# Altium project PCB_Project1.PrjPCB
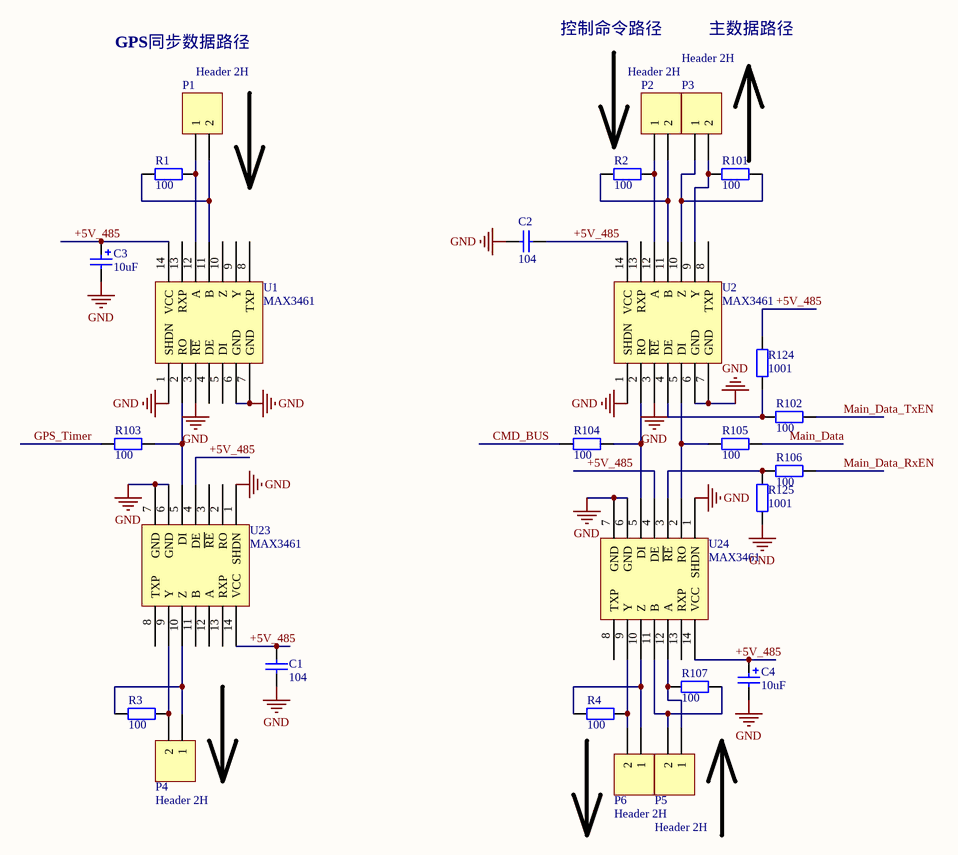
[diagram p0: 485Driver_MAX3462.SchDoc]
7 sheets, 381 parts. Net scope: global (net labels, ports and power ports of the same name join across sheets).
Board file: PCB1.PcbDoc
Sheets:
  485Driver_MAX3462.SchDoc
  CH1_CH2.SchDoc
  CH3.SchDoc
  Power.SchDoc
  EP3CE75F484.SchDoc
  STM32F103RBT6.SchDoc
  FPGA_POWER.SchDoc

## Sheet 485Driver_MAX3462.SchDoc
size A4

### Parts
C1  104  [0805C]
C2  104  [0805C]
C3  10uF  [C68uF]
C4  10uF  [C68uF]
P1  Header 2H  [HDR1X2]
P2  Header 2H  [HDR1X2]
P3  Header 2H  [HDR1X2]
P4  Header 2H  [HDR1X2]
P5  Header 2H  [HDR1X2]
P6  Header 2H  [HDR1X2]
R1  100  [0805R]
R2  100  [0805R]
R3  100  [0805R]
R4  100  [0805R]
R101  100  [0805R]
R102  100  [0603]
R103  100  [0603]
R104  100  [0603]
R105  100  [0603]
R106  100  [0603]
R107  100  [0805R]
R124  1001  [0603]
R125  1001  [0603]
U1  MAX3461  [SOP14]
U2  MAX3461  [SOP14]
U23  MAX3461  [SOP14]
U24  MAX3461  [SOP14]

### Nets
GND: C1.1 C2.1 C3.2 C4.2 R125.2 U1.1(SHDN) U1.3(~{RE}) U1.6(GND) U1.7(GND) U2.1(SHDN) U2.3(~{RE}) U2.6(GND) U2.7(GND) U23.1(SHDN) U23.6(GND) U23.7(GND) U24.1(SHDN) U24.6(GND) U24.7(GND)  [project net DGND]
+5V_485: C1.2 C2.2 C3.1 C4.1 R124.1 U1.14(VCC) U2.14(VCC) U23.4(DE) U23.14(VCC) U24.4(DE) U24.14(VCC)
CMD_BUS: R104.2
GPS_Timer: R103.2
Main_Data: R105.1
Main_Data_RxEN: R106.1
Main_Data_TxEN: R102.1
NetP1_1: P1.1 R1.1 U1.12(A)
NetP1_2: P1.2 R1.2 U1.11(B)
NetP2_1: P2.1 R2.1 U2.12(A)
NetP2_2: P2.2 R2.2 U2.11(B)
NetP3_1: P3.1 R101.1 U2.10(Z)
NetP3_2: P3.2 R101.2 U2.9(Y)
NetP4_1: P4.1 R3.2 U23.10(Z)
NetP4_2: P4.2 R3.1 U23.9(Y)
NetP5_1: P5.1 R107.2 U24.12(A)
NetP5_2: P5.2 R107.1 U24.11(B)
NetP6_1: P6.1 R4.2 U24.10(Z)
NetP6_2: P6.2 R4.1 U24.9(Y)
NetR102_2: R102.2 R124.2 U2.4(DE)
NetR103_1: R103.1 U1.2(RO) U23.5(DI)
NetR104_1: R104.1 U2.2(RO) U24.5(DI)
NetR105_2: R105.2 U2.5(DI) U24.2(RO)
NetR106_2: R106.2 R125.1 U24.3(~{RE})

Not connected (* = marked no-connect by the designer): U1 4(DE) 5(DI) 8(TXP) 9(Y) 10(Z) 13(RXP); U2 8(TXP) 13(RXP); U23 2(RO) 3(~{RE}) 8(TXP) 11(B) 12(A) 13(RXP); U24 8(TXP) 13(RXP)

### Notes on the sheet
- 控制命令路径
- 主数据路径
- GPS同步数据路径

### Library data of the parts
C1 C2 = Cap: Capacitor; Value: 100nF; Published: 8-Jun-2000; LatestRevisionDate: 17-Jul-2002; LatestRevisionNote: Re-released for DXP Platform.; PackageReference: RAD-0.3; Publisher: Altium Limited
C3 C4 = Cap Pol2: Polarized Capacitor (Axial); Value: 100pF; Published: 8-Jun-2000; LatestRevisionDate: 17-Jul-2002; LatestRevisionNote: Re-released for DXP Platform.; PackageReference: POLAR0.8; Publisher: Altium Limited
P1-P6 = Header 2H: Header, 2-Pin, Right Angle; LatestRevisionDate: 17-Jul-2002; LatestRevisionNote: Re-released for DXP Platform.; Publisher: Altium Limited
R1-R4 R101-R107 R124 R125 = Res2: Resistor; Value: 1K; Published: 8-Jun-2000; LatestRevisionDate: 17-Jul-2002; LatestRevisionNote: Re-released for DXP Platform.; PackageReference: AXIAL-0.4; Publisher: Altium Limited

## Sheet CH1_CH2.SchDoc
size A4
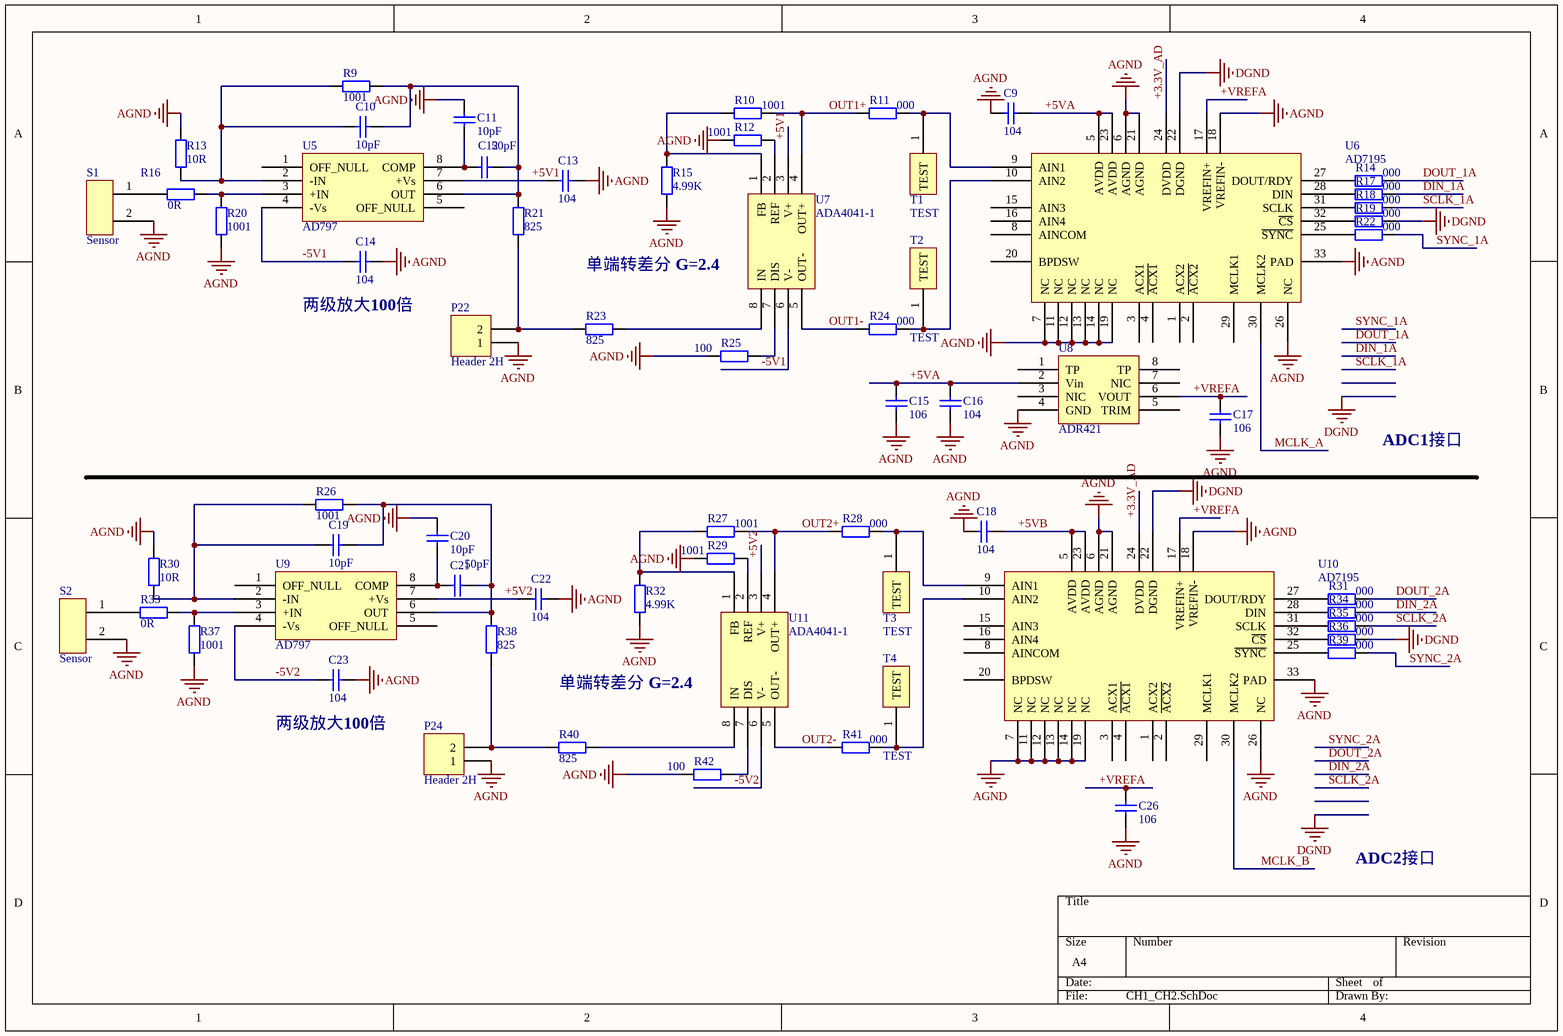
[diagram p1: CH1_CH2.SchDoc]

### Parts
C9  104  [0603]
C10  10pF  [0603]
C11  10pF  [0603]
C12  50pF  [0603]
C13  104  [0603]
C14  104  [0603]
C15  106  [0603]
C16  104  [0603]
C17  106  [0603]
C18  104  [0603]
C19  10pF  [0603]
C20  10pF  [0603]
C21  50pF  [0603]
C22  104  [0603]
C23  104  [0603]
C26  106  [0603]
P22  Header 2H  [HDR1X2]
P24  Header 2H  [HDR1X2]
R9  1001  [0603]  (net tie, no BOM)
R10  1001  [0603]  (net tie, no BOM)
R11  000  [0603]  (net tie, no BOM)
R12  1001  [0603]  (net tie, no BOM)
R13  10R  [0603]
R14  000  [0603]  (net tie, no BOM)
R15  4.99K  [0603]  (net tie, no BOM)
R16  0R  [0603]
R17  000  [0603]  (net tie, no BOM)
R18  000  [0603]  (net tie, no BOM)
R19  000  [0603]  (net tie, no BOM)
R20  1001  [0603]  (net tie, no BOM)
R21  825  [0603]  (net tie, no BOM)
R22  000  [0603]  (net tie, no BOM)
R23  825  [0603]  (net tie, no BOM)
R24  000  [0603]  (net tie, no BOM)
R25  100  [0603]  (net tie, no BOM)
R26  1001  [0603]  (net tie, no BOM)
R27  1001  [0603]  (net tie, no BOM)
R28  000  [0603]  (net tie, no BOM)
R29  1001  [0603]  (net tie, no BOM)
R30  10R  [0603]  (net tie, no BOM)
R31  000  [0603]  (net tie, no BOM)
R32  4.99K  [0603]  (net tie, no BOM)
R33  0R  [0603]  (net tie, no BOM)
R34  000  [0603]  (net tie, no BOM)
R35  000  [0603]  (net tie, no BOM)
R36  000  [0603]  (net tie, no BOM)
R37  1001  [0603]  (net tie, no BOM)
R38  825  [0603]  (net tie, no BOM)
R39  000  [0603]  (net tie, no BOM)
R40  825  [0603]  (net tie, no BOM)
R41  000  [0603]  (net tie, no BOM)
R42  100  [0603]  (net tie, no BOM)
S1  Sensor  [HDR1X2]
S2  Sensor  [HDR1X2]
T1  TEST  [TEST]
T2  TEST  [TEST]
T3  TEST  [TEST]
T4  TEST  [TEST]
U5  AD797  [SO8]
U6  AD7195  [VQFN32]
U7  ADA4041-1  [SO8]
U8  ADR421  [SO8]
U9  AD797  [SO8]
U10  AD7195  [VQFN32]
U11  ADA4041-1  [SO8]

### Nets
AGND: C9.1 C11.2 C13.1 C14.1 C15.2 C16.2 C17.2 C18.1 C20.2 C22.1 C23.1 C26.2 P22.1 P24.1 R12.1 R13.1 R15.1 R20.1 R25.1 R29.1 R30.1 R32.1 R37.1 R42.1 S1.2 S2.2 U6.6(AGND) U6.7(NC) U6.11(NC) U6.12(NC) U6.13(NC) U6.14(NC) U6.18(VREFIN-) U6.19(NC) U6.21(AGND) U6.26(NC) U6.33(PAD) U8.4(GND) U10.6(AGND) U10.7(NC) U10.11(NC) U10.12(NC) U10.13(NC) U10.14(NC) U10.18(VREFIN-) U10.19(NC) U10.21(AGND) U10.26(NC) U10.33(PAD)
DGND: R19.2 R36.2 U6.22(DGND) U10.22(DGND)
+3.3V_AD: U6.24(DVDD) U10.24(DVDD)
+5V1: C13.2 U5.7(+Vs) U7.3(V+)
+5V2: C22.2 U9.7(+Vs) U11.3(V+)
+5VA: C9.2 C15.1 C16.1 U6.5(AVDD) U6.23(AVDD) U8.2(Vin)
+5VB: C18.2 U10.5(AVDD) U10.23(AVDD)
+VREFA: C17.1 C26.1 U6.17(VREFIN+) U8.6(VOUT) U10.17(VREFIN+)
-5V1: C14.2 U5.4(-Vs) U7.6(V-)
-5V2: C23.2 U9.4(-Vs) U11.6(V-)
DIN_1A: R17.2
DIN_2A: R34.2
DOUT_1A: R14.2
DOUT_2A: R31.2
MCLK_A: U6.30(MCLK2)
MCLK_B: U10.30(MCLK2)
OUT1+: R10.2 R11.1 U7.4(OUT+)
OUT1-: R24.1 U7.5(OUT-)
OUT2+: R27.2 R28.1 U11.4(OUT+)
OUT2-: R41.1 U11.5(OUT-)
SCLK_1A: R18.2
SCLK_2A: R35.2
SYNC_1A: R22.2
SYNC_2A: R39.2
NetC10_1: C10.1 C12.1 R9.2 R21.2 U5.6(OUT)
NetC10_2: C10.2 R9.1 R13.2 U5.2(-IN)
NetC11_1: C11.1 C12.2 U5.8(COMP)
NetC19_1: C19.1 C21.1 R26.2 R38.2 U9.6(OUT)
NetC19_2: C19.2 R26.1 R30.2 U9.2(-IN)
NetC20_1: C20.1 C21.2 U9.8(COMP)
NetP22_2: P22.2 R21.1 R23.1
NetP24_2: P24.2 R38.1 R40.1
NetR10_1: R10.1 R15.2 U7.1(FB)
NetR11_2: R11.2 T1.1(TEST) U6.9(AIN1)
NetR12_2: R12.2 U7.2(REF)
NetR14_1: R14.1 U6.27(DOUT/RDY)
NetR16_1: R16.1 S1.1
NetR16_2: R16.2 R20.2 U5.3(+IN)
NetR17_1: R17.1 U6.28(DIN)
NetR18_1: R18.1 U6.31(SCLK)
NetR19_1: R19.1 U6.32(~{CS})
NetR22_1: R22.1 U6.25(~{SYNC})
NetR23_2: R23.2 U7.8(IN)
NetR24_2: R24.2 T2.1(TEST) U6.10(AIN2)
NetR25_2: R25.2 U7.7(DIS)
NetR27_1: R27.1 R32.2 U11.1(FB)
NetR28_2: R28.2 T3.1(TEST) U10.9(AIN1)
NetR29_2: R29.2 U11.2(REF)
NetR31_1: R31.1 U10.27(DOUT/RDY)
NetR33_1: R33.1 S2.1
NetR33_2: R33.2 R37.2 U9.3(+IN)
NetR34_1: R34.1 U10.28(DIN)
NetR35_1: R35.1 U10.31(SCLK)
NetR36_1: R36.1 U10.32(~{CS})
NetR39_1: R39.1 U10.25(~{SYNC})
NetR40_2: R40.2 U11.8(IN)
NetR41_2: R41.2 T4.1(TEST) U10.10(AIN2)
NetR42_2: R42.2 U11.7(DIS)

Not connected (* = marked no-connect by the designer): U5 1(OFF_NULL) 5(OFF_NULL); U6 1(ACX2) 2(~{ACX2}) 3(ACX1) 4(~{ACX1}) 8(AINCOM) 15(AIN3) 16(AIN4) 20(BPDSW) 29(MCLK1); U8 1(TP) 3(NIC) 5(TRIM) 7(NIC) 8(TP); U9 1(OFF_NULL) 5(OFF_NULL); U10 1(ACX2) 2(~{ACX2}) 3(ACX1) 4(~{ACX1}) 8(AINCOM) 15(AIN3) 16(AIN4) 20(BPDSW) 29(MCLK1)

### Notes on the sheet
- (near C14) 两级放大100倍
- 单端转差分 G=2.4
- ADC1接口
- (near C23) 两级放大100倍
- ADC2接口

### Library data of the parts
C9-C23 C26 = Cap: Capacitor; Value: 100nF; Published: 8-Jun-2000; LatestRevisionDate: 17-Jul-2002; LatestRevisionNote: Re-released for DXP Platform.; PackageReference: RAD-0.3; Publisher: Altium Limited
P22 P24 = Header 2H: Header, 2-Pin, Right Angle; LatestRevisionDate: 17-Jul-2002; LatestRevisionNote: Re-released for DXP Platform.; Publisher: Altium Limited
R9-R15 R17-R32 R34-R42 = Res2: Resistor; Value: 1K; Published: 8-Jun-2000; LatestRevisionDate: 17-Jul-2002; LatestRevisionNote: Re-released for DXP Platform.; PackageReference: AXIAL-0.4; Publisher: Altium Limited
R16 R33 = Res2: Resistor; Value: 0; Published: 8-Jun-2000; LatestRevisionDate: 17-Jul-2002; LatestRevisionNote: Re-released for DXP Platform.; PackageReference: AXIAL-0.4; Publisher: Altium Limited

## Sheet CH3.SchDoc
size A4
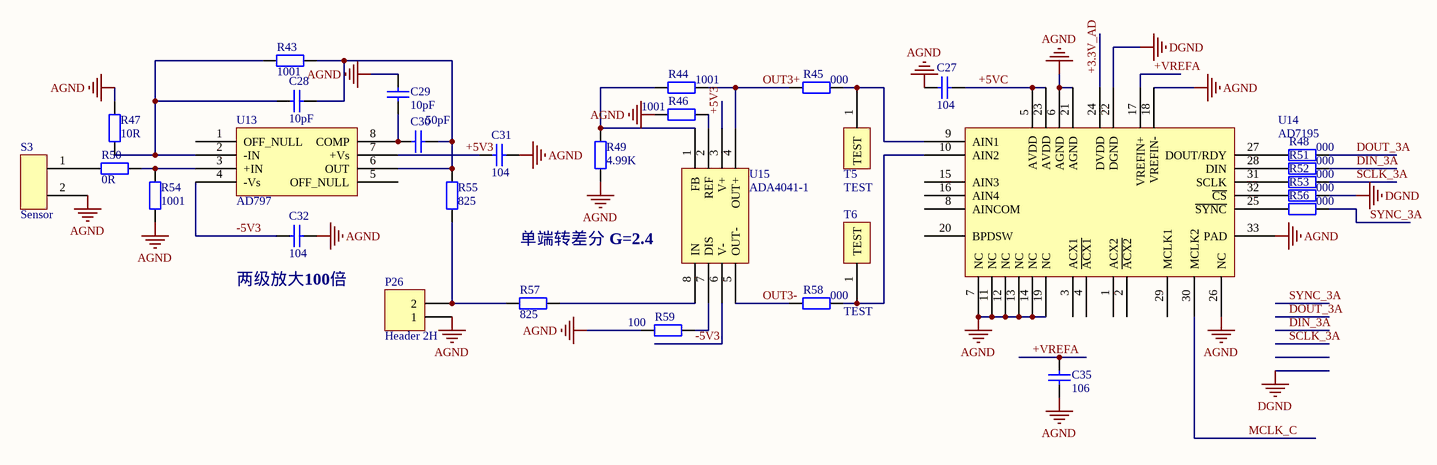
[diagram p2: CH3.SchDoc]

### Parts
C27  104  [0603]
C28  10pF  [0603]
C29  10pF  [0603]
C30  50pF  [0603]
C31  104  [0603]
C32  104  [0603]
C35  106  [0603]
P26  Header 2H  [HDR1X2]
R43  1001  [0603]  (net tie, no BOM)
R44  1001  [0603]  (net tie, no BOM)
R45  000  [0603]  (net tie, no BOM)
R46  1001  [0603]  (net tie, no BOM)
R47  10R  [0603]
R48  000  [0603]  (net tie, no BOM)
R49  4.99K  [0603]  (net tie, no BOM)
R50  0R  [0603]
R51  000  [0603]  (net tie, no BOM)
R52  000  [0603]  (net tie, no BOM)
R53  000  [0603]  (net tie, no BOM)
R54  1001  [0603]  (net tie, no BOM)
R55  825  [0603]  (net tie, no BOM)
R56  000  [0603]  (net tie, no BOM)
R57  825  [0603]  (net tie, no BOM)
R58  000  [0603]  (net tie, no BOM)
R59  100  [0603]  (net tie, no BOM)
S3  Sensor  [HDR1X2]
T5  TEST  [TEST]
T6  TEST  [TEST]
U13  AD797  [SO8]
U14  AD7195  [VQFN32]
U15  ADA4041-1  [SO8]

### Nets
AGND: C27.1 C29.2 C31.1 C32.1 C35.2 P26.1 R46.1 R47.1 R49.1 R54.1 R59.1 S3.2 U14.6(AGND) U14.7(NC) U14.11(NC) U14.12(NC) U14.13(NC) U14.14(NC) U14.18(VREFIN-) U14.19(NC) U14.21(AGND) U14.26(NC) U14.33(PAD)
DGND: R53.2 U14.22(DGND)
+3.3V_AD: U14.24(DVDD)
+5V3: C31.2 U13.7(+Vs) U15.3(V+)
+5VC: C27.2 U14.5(AVDD) U14.23(AVDD)
+VREFA: C35.1 U14.17(VREFIN+)
-5V3: C32.2 U13.4(-Vs) U15.6(V-)
DIN_3A: R51.2
DOUT_3A: R48.2
MCLK_C: U14.30(MCLK2)
OUT3+: R44.2 R45.1 U15.4(OUT+)
OUT3-: R58.1 U15.5(OUT-)
SCLK_3A: R52.2
SYNC_3A: R56.2
NetC28_1: C28.1 C30.1 R43.2 R55.2 U13.6(OUT)
NetC28_2: C28.2 R43.1 R47.2 U13.2(-IN)
NetC29_1: C29.1 C30.2 U13.8(COMP)
NetP26_2: P26.2 R55.1 R57.1
NetR44_1: R44.1 R49.2 U15.1(FB)
NetR45_2: R45.2 T5.1(TEST) U14.9(AIN1)
NetR46_2: R46.2 U15.2(REF)
NetR48_1: R48.1 U14.27(DOUT/RDY)
NetR50_1: R50.1 S3.1
NetR50_2: R50.2 R54.2 U13.3(+IN)
NetR51_1: R51.1 U14.28(DIN)
NetR52_1: R52.1 U14.31(SCLK)
NetR53_1: R53.1 U14.32(~{CS})
NetR56_1: R56.1 U14.25(~{SYNC})
NetR57_2: R57.2 U15.8(IN)
NetR58_2: R58.2 T6.1(TEST) U14.10(AIN2)
NetR59_2: R59.2 U15.7(DIS)

Not connected (* = marked no-connect by the designer): U13 1(OFF_NULL) 5(OFF_NULL); U14 1(ACX2) 2(~{ACX2}) 3(ACX1) 4(~{ACX1}) 8(AINCOM) 15(AIN3) 16(AIN4) 20(BPDSW) 29(MCLK1)

### Notes on the sheet
- 单端转差分 G=2.4
- (near C32) 两级放大100倍

### Library data of the parts
C27-C32 C35 = Cap: Capacitor; Value: 100nF; Published: 8-Jun-2000; LatestRevisionDate: 17-Jul-2002; LatestRevisionNote: Re-released for DXP Platform.; PackageReference: RAD-0.3; Publisher: Altium Limited
P26 = Header 2H: Header, 2-Pin, Right Angle; LatestRevisionDate: 17-Jul-2002; LatestRevisionNote: Re-released for DXP Platform.; Publisher: Altium Limited
R43-R49 R51-R59 = Res2: Resistor; Value: 1K; Published: 8-Jun-2000; LatestRevisionDate: 17-Jul-2002; LatestRevisionNote: Re-released for DXP Platform.; PackageReference: AXIAL-0.4; Publisher: Altium Limited
R50 = Res2: Resistor; Value: 0; Published: 8-Jun-2000; LatestRevisionDate: 17-Jul-2002; LatestRevisionNote: Re-released for DXP Platform.; PackageReference: AXIAL-0.4; Publisher: Altium Limited

## Sheet Power.SchDoc
size A4
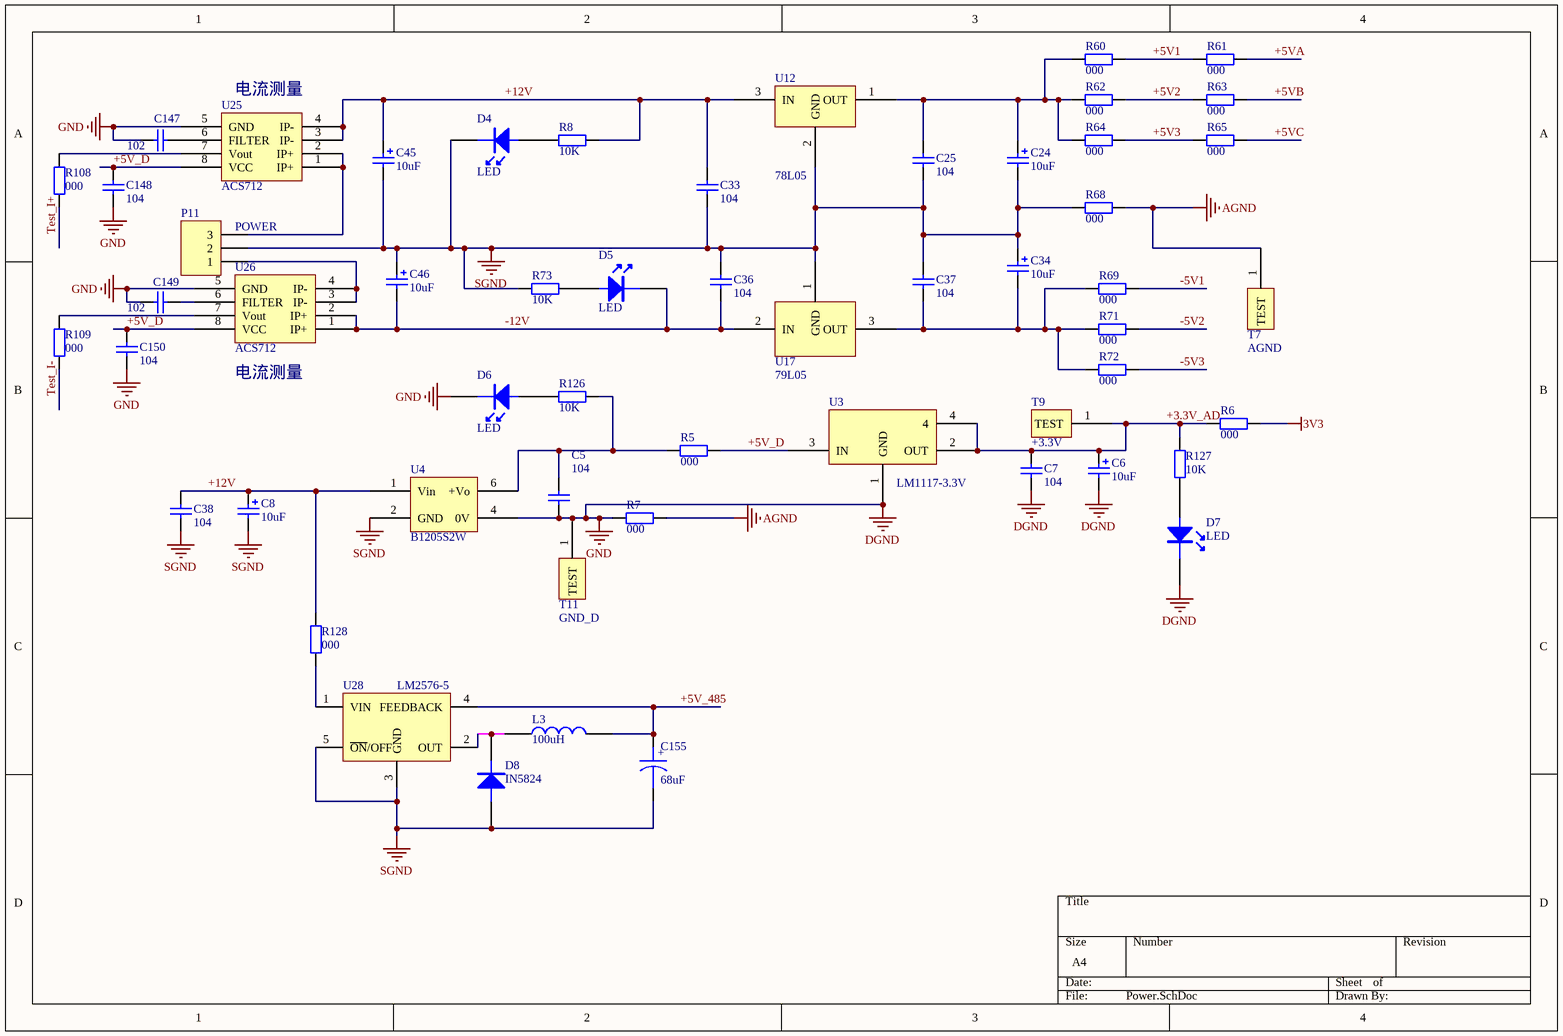
[diagram p3: Power.SchDoc]

### Parts
C5  104  [0805C]
C6  10uF  [C68uF]
C7  104  [0805C]
C8  10uF  [C68uF]
C24  10uF  [C68uF]
C25  104  [0805C]
C33  104  [0805C]
C34  10uF  [C68uF]
C36  104  [0805C]
C37  104  [0805C]
C38  104  [0805C]
C45  10uF  [C68uF]
C46  10uF  [C68uF]
C147  102  [0603]
C148  104  [0603]
C149  102  [0603]
C150  104  [0603]
C155  68uF  [C68uF]
D4  LED  [0805_LED]
D5  LED  [0805_LED]
D6  LED  [0805_LED]
D7  LED  [0805_LED]
D8  IN5824  [1N5824]
L3  100uH  [L100uH]
P11  POWER  [SIP3-5.08mm]
R5  000  [0805R]
R6  000  [0805R]
R7  000  [0805R]
R8  value 10K  [0603]  (hidden comment: Res2)
R60  000  [0805R]
R61  000  [0805R]
R62  000  [0805R]
R63  000  [0805R]
R64  000  [0805R]
R65  000  [0805R]
R68  000  [0805R]
R69  000  [0805R]
R71  000  [0805R]
R72  000  [0805R]
R73  value 10K  [0603]  (hidden comment: Res2)
R108  000  [0603]  (net tie, no BOM)
R109  000  [0603]  (net tie, no BOM)
R126  value 10K  [0603]  (hidden comment: Res2)
R127  value 10K  [0603]  (hidden comment: Res2)
R128  000  [0805R]
T7  AGND  [TEST]
T9  +3.3V  [TEST]
T11  GND_D  [TEST]
U3  LM1117-3.3V  [SOT223]
U4  B1205S2W  [B1205SW]
U12  78L05  [SOT89-M]
U17  79L05
U25  ACS712  [SO8]
U26  ACS712  [SO8]
U28  LM2576-5  [lm2596]

### Nets
3V3: R6.1
AGND: R7.1 R68.1 T7.1(TEST)
DGND: C5.2 C6.2 C7.2 C147.1 C148.2 C149.1 C150.2 D6.2(K) D7.2(K) R7.2 T11.1(TEST) U3.1(GND) U4.4(0V) U25.5(GND) U26.5(GND)  [also labelled GND]
SGND: C8.2 C24.2 C25.2 C33.2 C34.1 C36.1 C37.1 C38.2 C45.2 C46.1 C155.2 D4.2(K) D8.1(A) P11.2 R68.2 R73.2 U4.2(GND) U12.2(GND) U17.1(GND) U28.3(GND) U28.5(~{ON}/OFF)
+3.3V_AD: C6.1 C7.1 R6.2 R127.2 T9.1(TEST) U3.2(OUT) U3.4
+5V1: R60.1 R61.2
+5V2: R62.1 R63.2
+5V3: R64.1 R65.2
+5V_485: C155.1 L3.2 U28.4(FEEDBACK)
+5V_D: C148.1 C150.1 R5.1 U3.3(IN) U25.8(VCC) U26.8(VCC)
+5VA: R61.1
+5VB: R63.1
+5VC: R65.1
+12V: C8.1 C33.1 C38.1 C45.1 R8.2 R128.1 U4.1(Vin) U12.3(IN) U25.3(IP-) U25.4(IP-)
-5V1: R69.1
-5V2: R71.1
-5V3: R72.1
-12V: C36.2 C46.2 D5.2(K) U17.2(IN) U26.1(IP+) U26.2(IP+)
Test_I+: R108.1
Test_I-: R109.1
NetC5_1: C5.1 R5.2 R126.2 U4.6(+Vo)
NetC24_1: C24.1 C25.1 R60.2 R62.2 R64.2 U12.1(OUT)
NetC34_2: C34.2 C37.2 R69.2 R71.2 R72.2 U17.3(OUT)
NetC147_2: C147.2 U25.6(FILTER)
NetC149_2: C149.2 U26.6(FILTER)
NetD4_1: D4.1(A) R8.1
NetD5_1: D5.1(A) R73.1
NetD6_1: D6.1(A) R126.1
NetD7_1: D7.1(A) R127.1
NetD8_2: D8.2(K) L3.1 U28.2(OUT)
NetP11_1: P11.1 U26.3(IP-) U26.4(IP-)
NetP11_3: P11.3 U25.1(IP+) U25.2(IP+)
NetR108_2: R108.2 U25.7(Vout)
NetR109_2: R109.2 U26.7(Vout)
NetR128_2: R128.2 U28.1(VIN)

### Notes on the sheet
- (near U25) 电流测量
- (near U26) 电流测量
- (in symbol CAPACITOR POL) +

### Library data of the parts
C5 C7 C25 C33 C36-C38 C147-C150 = Cap: Capacitor; Value: 100nF; Published: 8-Jun-2000; LatestRevisionDate: 17-Jul-2002; LatestRevisionNote: Re-released for DXP Platform.; PackageReference: RAD-0.3; Publisher: Altium Limited
C6 C8 C24 C34 C45 C46 = Cap Pol2: as C3 on sheet 485Driver_MAX3462; Published: 8-Jun-2000; LatestRevisionDate: 17-Jul-2002; LatestRevisionNote: Re-released for DXP Platform.; PackageReference: POLAR0.8; Publisher: Altium Limited
C155 = CAPACITOR POL: Capacitor
D8 = DIODE
L3 = INDUCTOR
P11 = Header 3: Header, 3-Pin; LatestRevisionDate: 17-Jul-2002; LatestRevisionNote: Re-released for DXP Platform.; Publisher: Altium Limited
R5-R7 R60-R65 R68 R69 R71 R72 R108 R109 R128 = Res2: Resistor; Value: 1K; Published: 8-Jun-2000; LatestRevisionDate: 17-Jul-2002; LatestRevisionNote: Re-released for DXP Platform.; PackageReference: AXIAL-0.4; Publisher: Altium Limited
R8 R73 R126 R127 = Res2: Resistor; Published: 8-Jun-2000; LatestRevisionDate: 17-Jul-2002; LatestRevisionNote: Re-released for DXP Platform.; PackageReference: AXIAL-0.4; Publisher: Altium Limited
T7 T9 T11 = TEST
U28 = LM2596-5

## Sheet EP3CE75F484.SchDoc
size A1
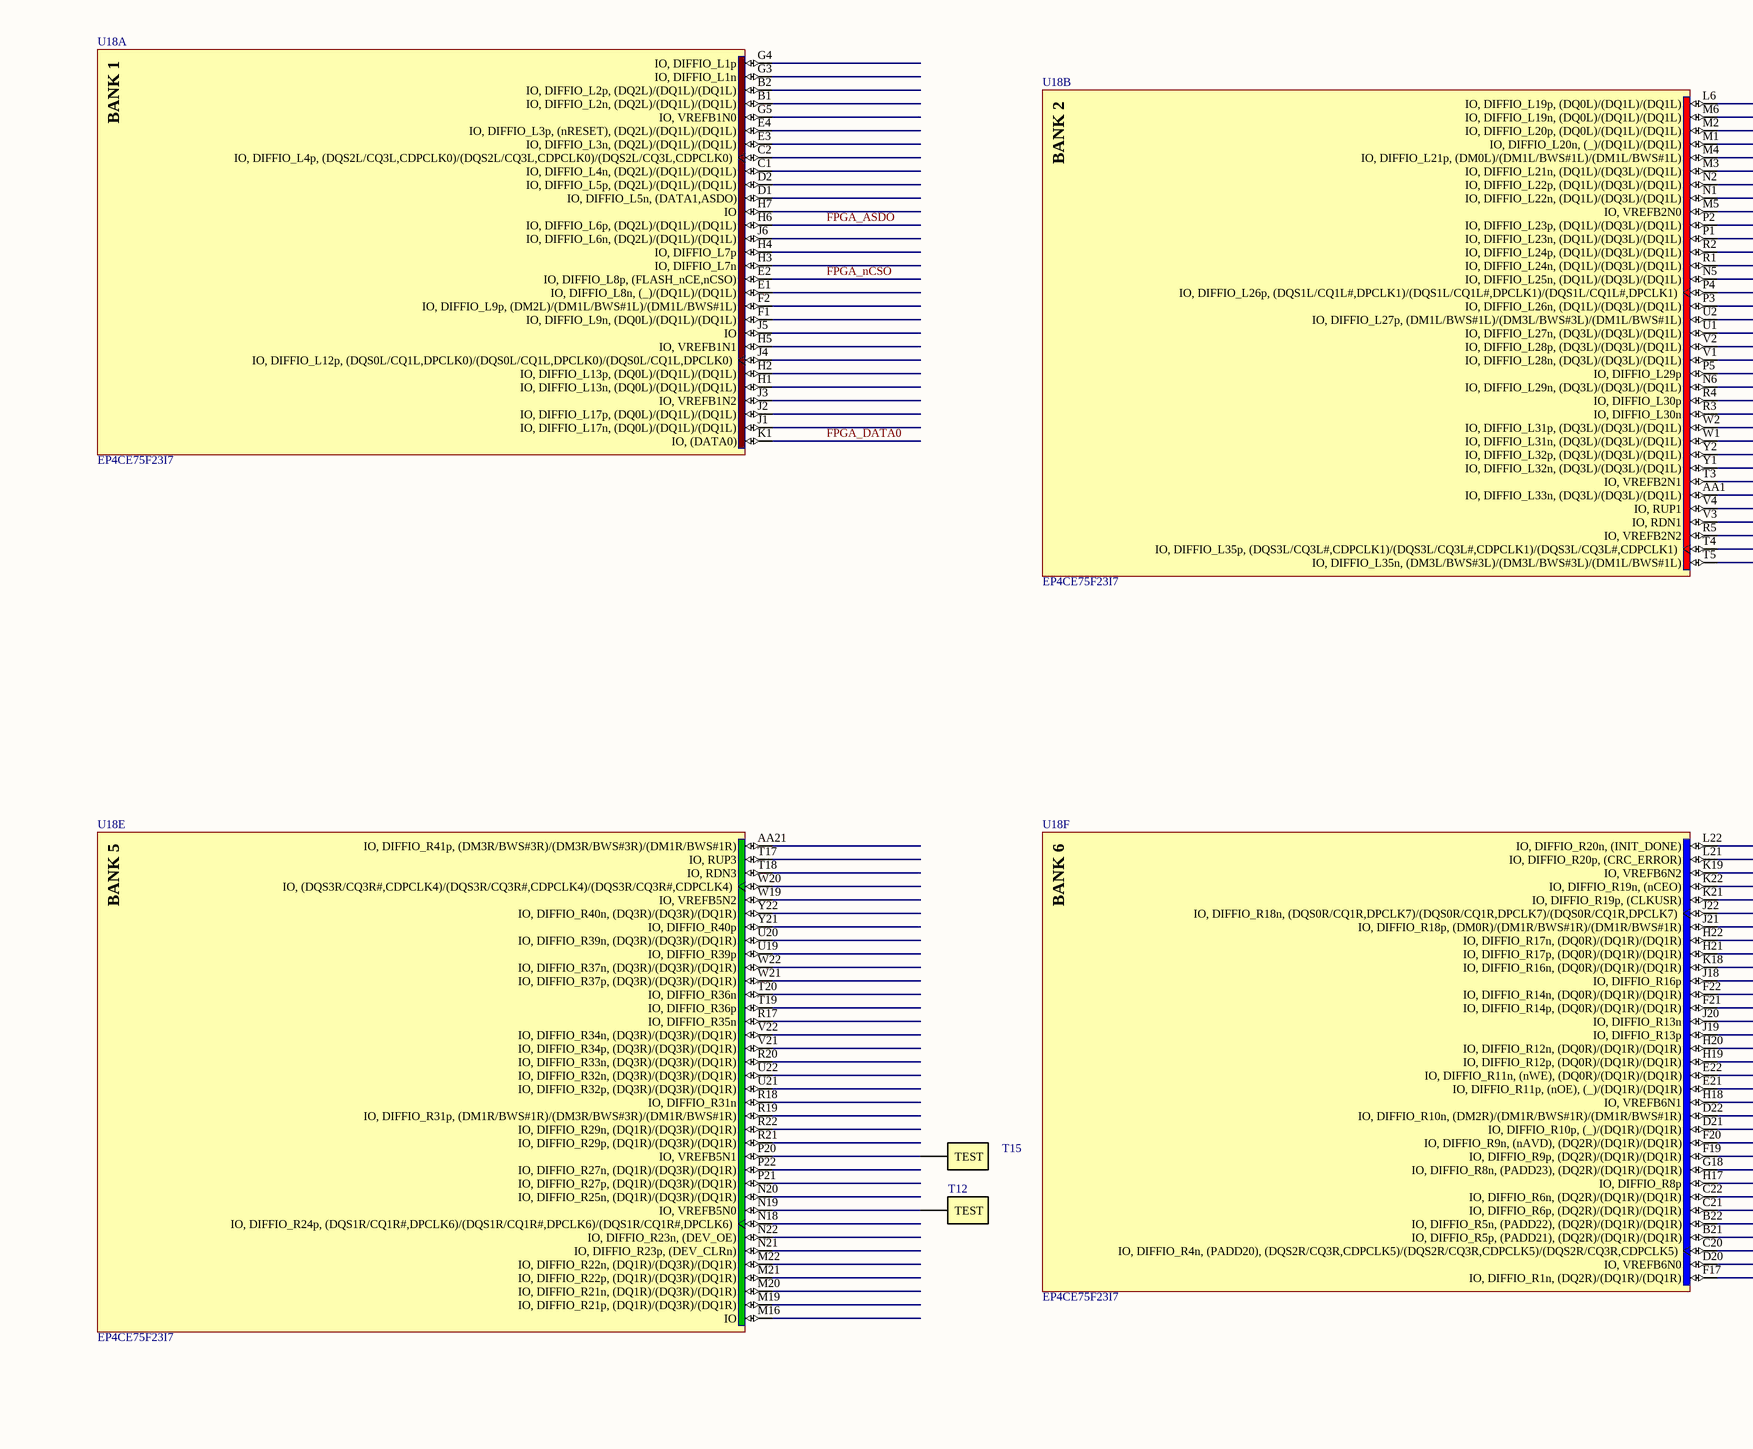
[diagram p4: EP3CE75F484.SchDoc, top left]
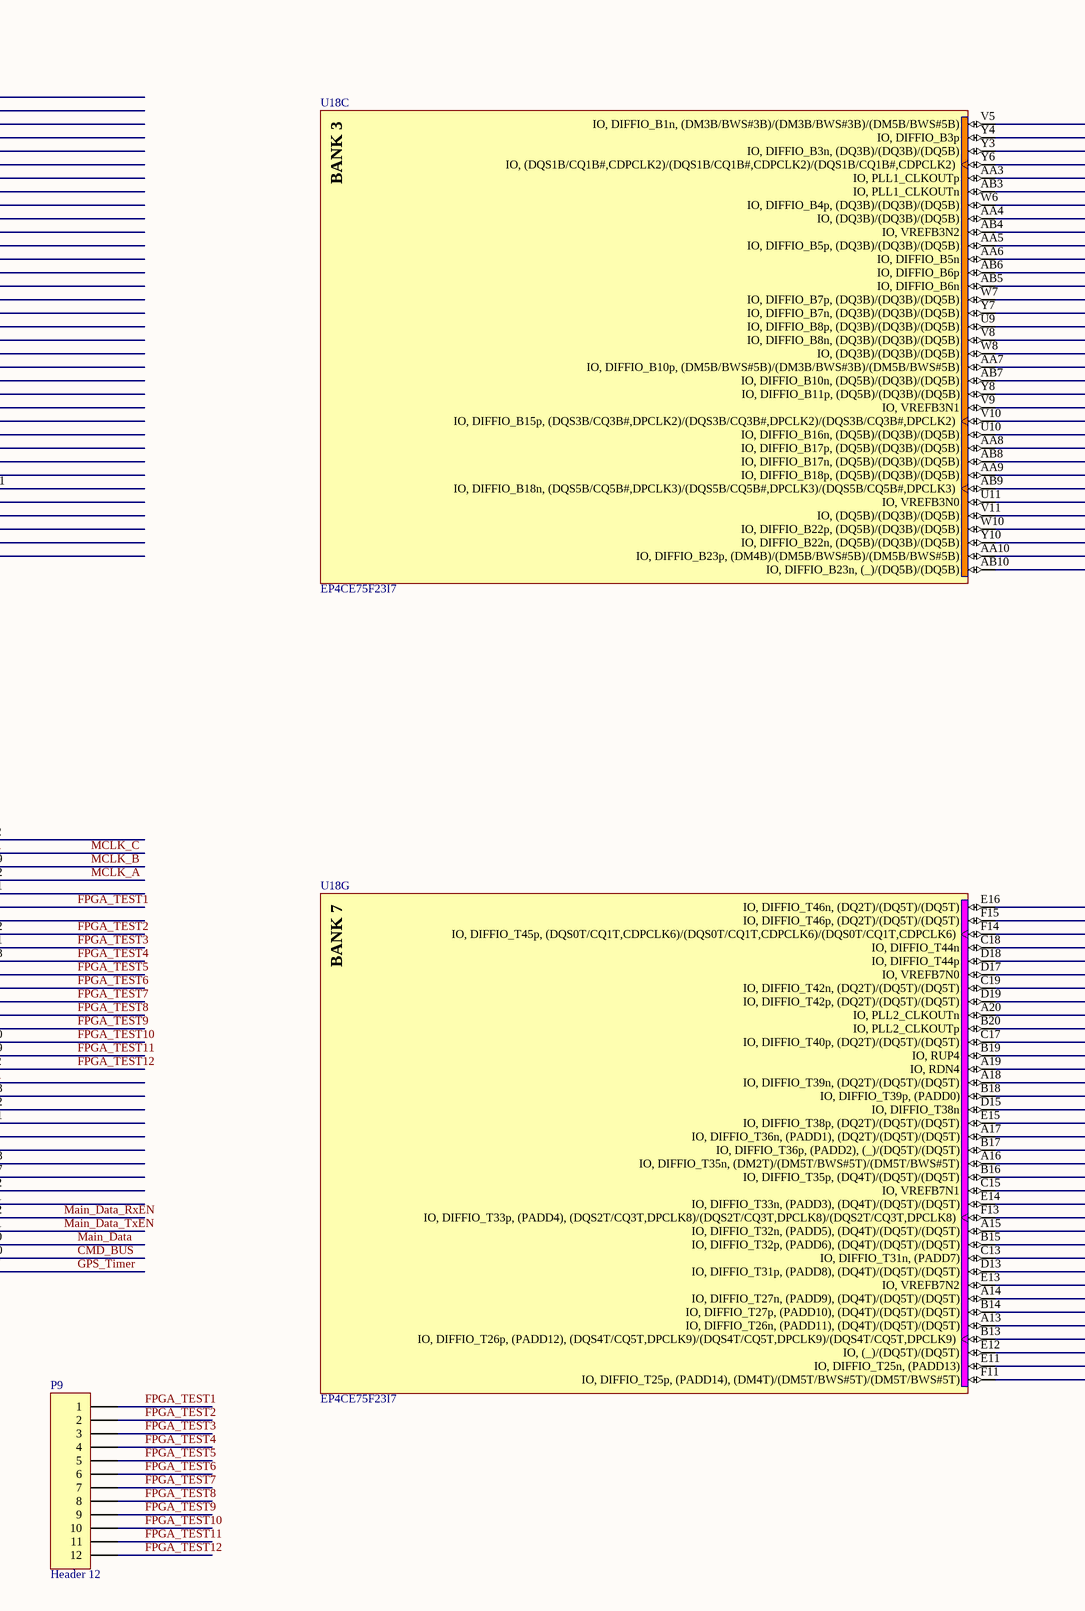
[diagram p5: EP3CE75F484.SchDoc, top middle]
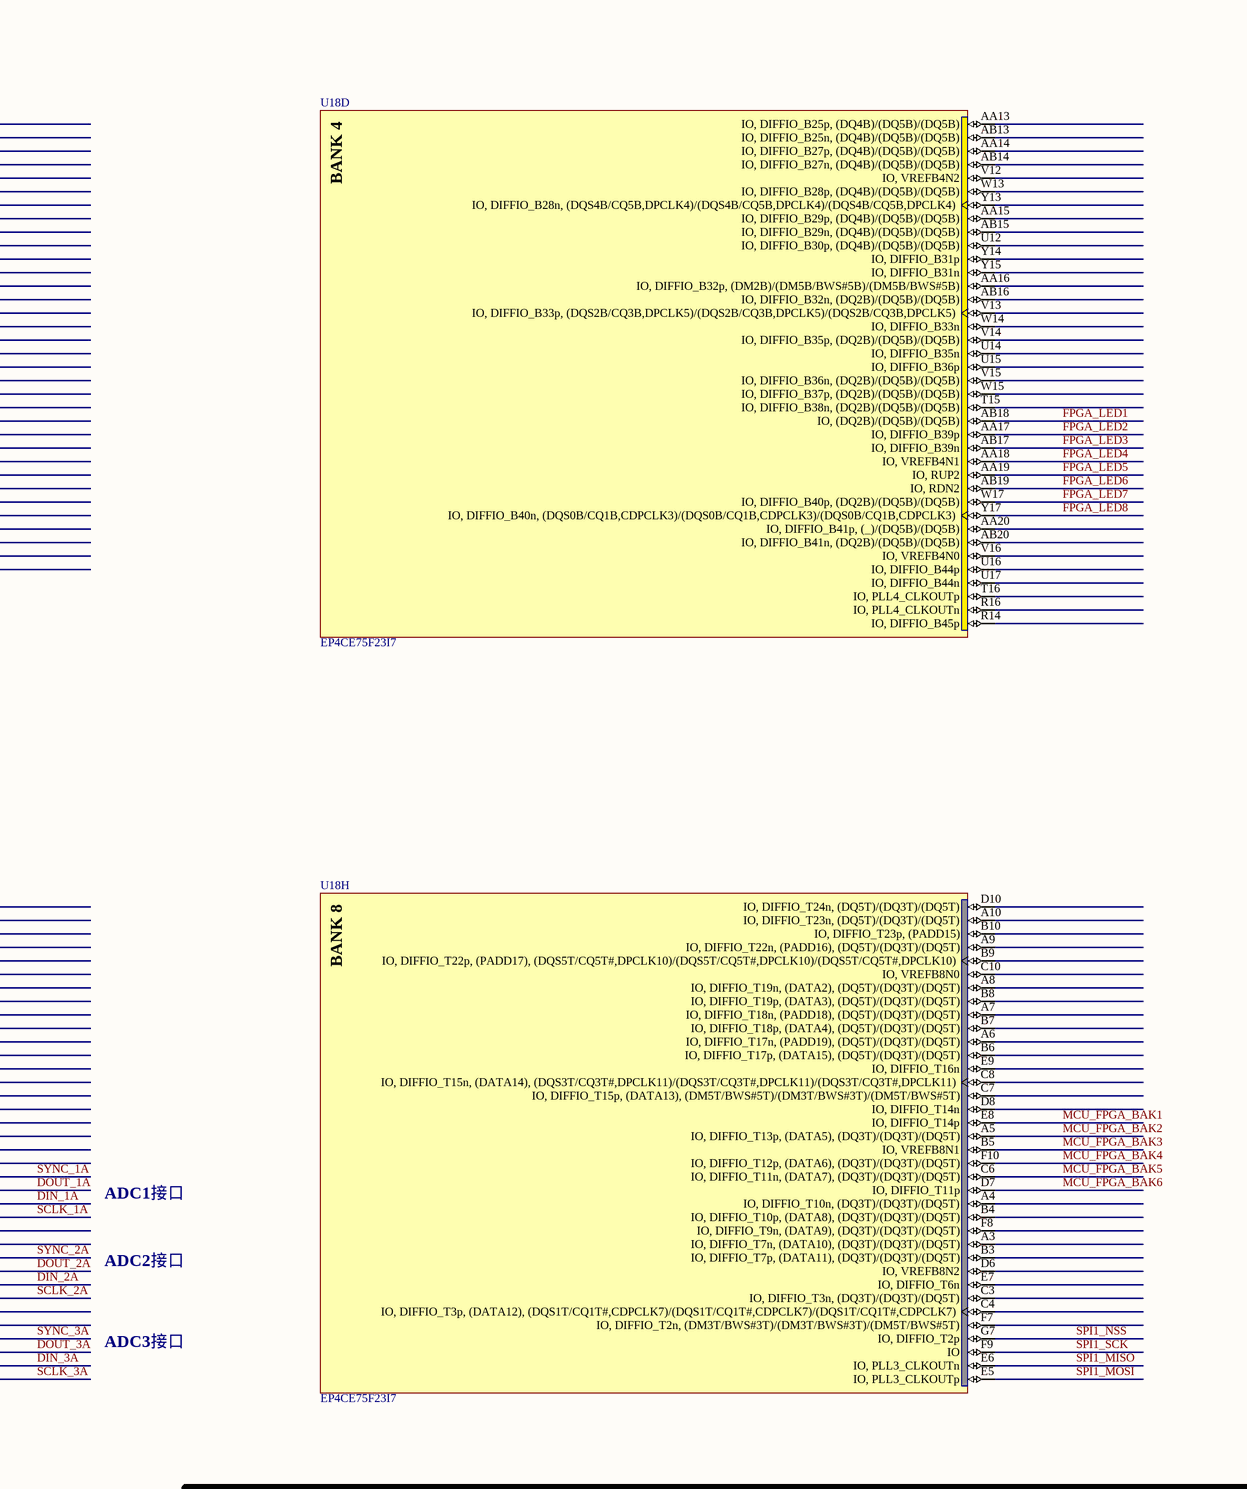
[diagram p6: EP3CE75F484.SchDoc, top right]
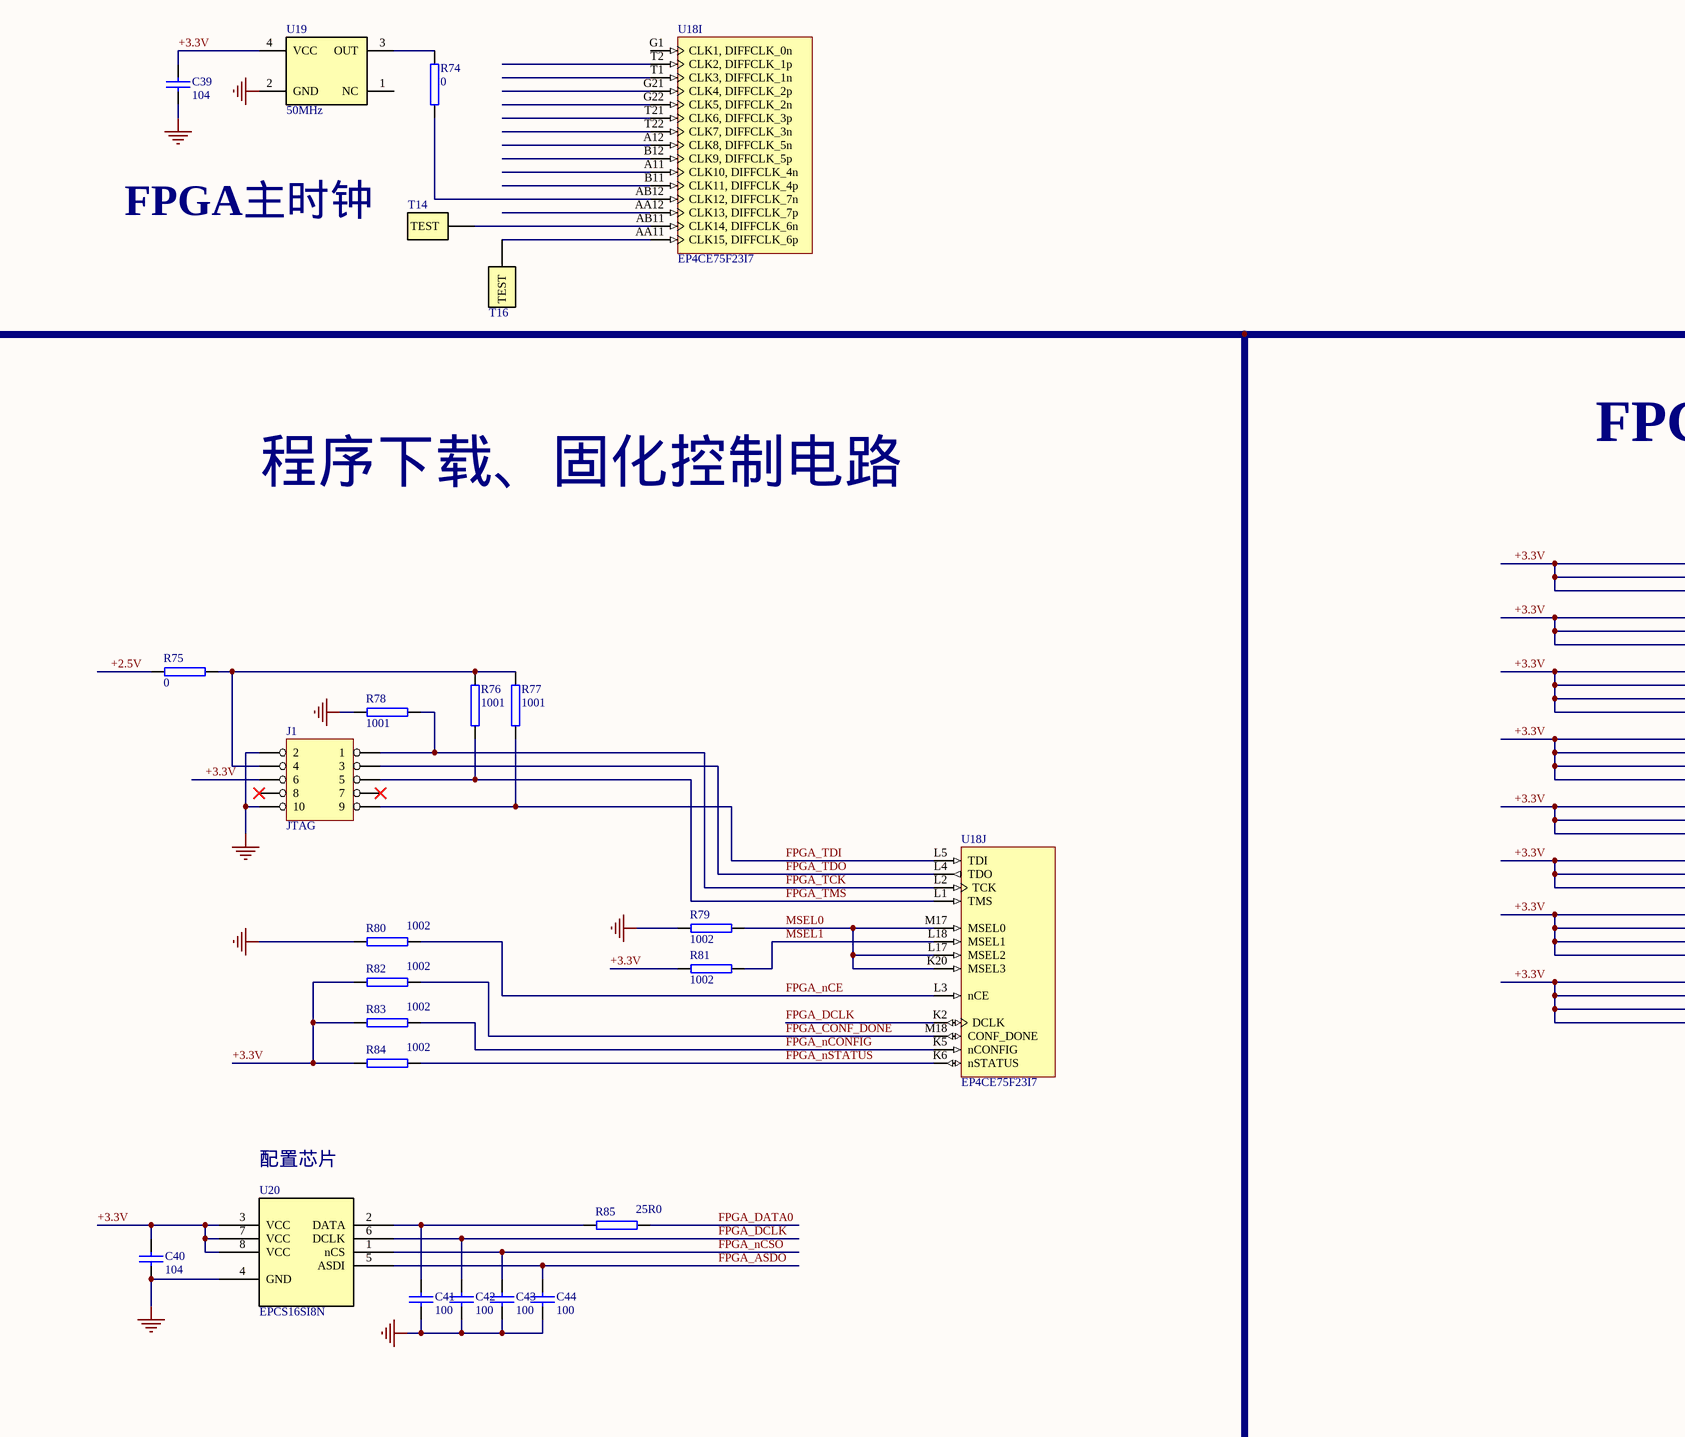
[diagram p7: EP3CE75F484.SchDoc, bottom left]
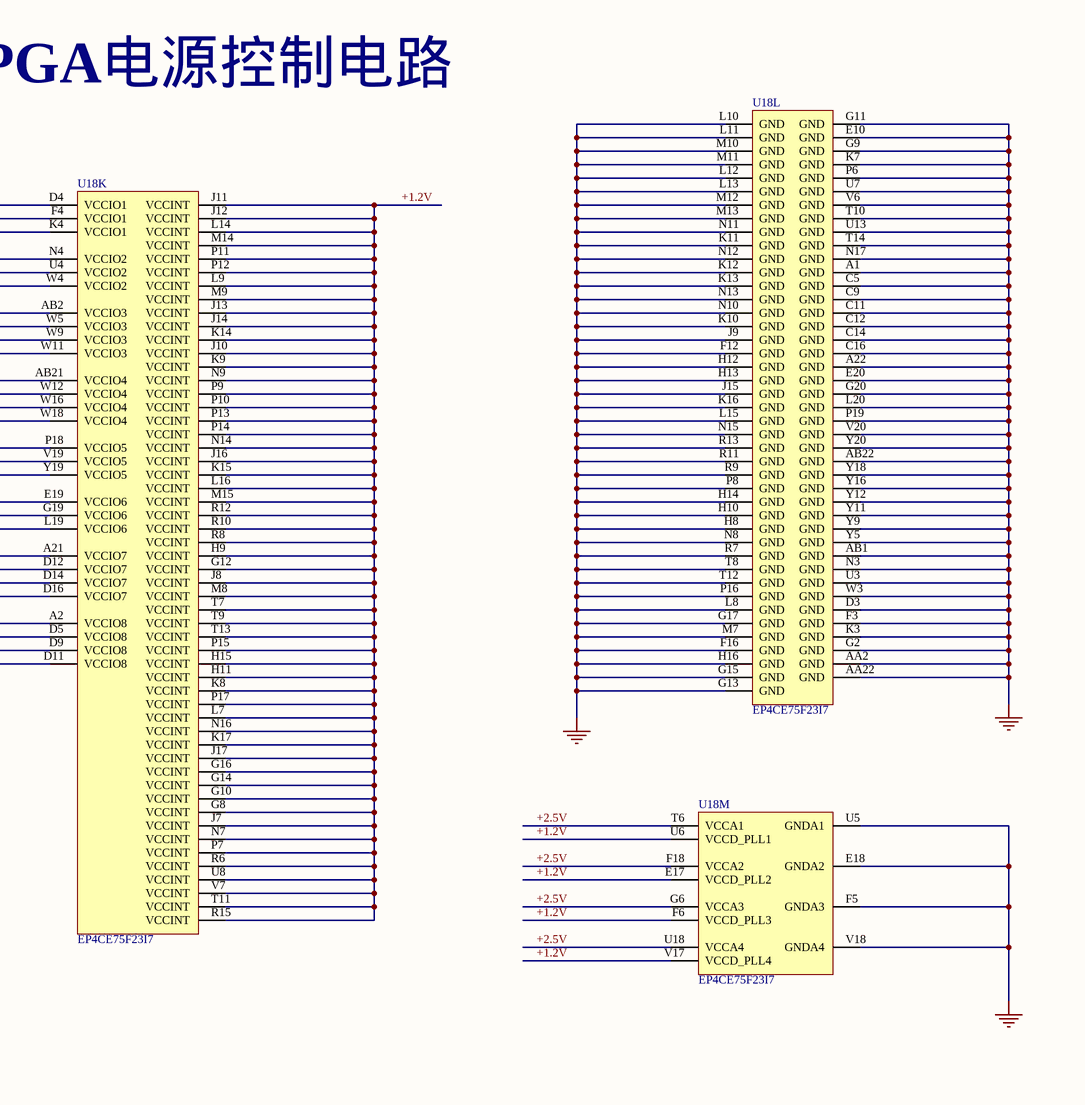
[diagram p8: EP3CE75F484.SchDoc, bottom middle]
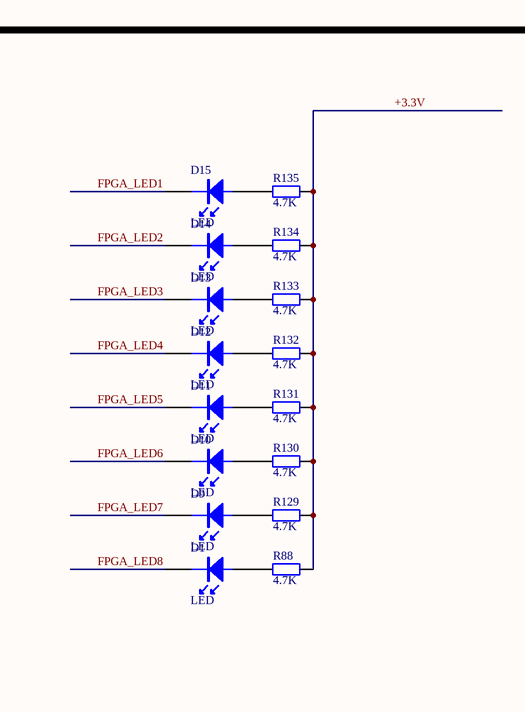
[diagram p9: EP3CE75F484.SchDoc, bottom right]

### Parts
C39  104  [0603]
C40  104  [0603]
C41  100  [0603]
C42  100  [0603]
C43  100  [0603]
C44  100  [0603]
D1  LED  [0805_LED]
D9  LED  [0805_LED]
D10  LED  [0805_LED]
D11  LED  [0805_LED]
D12  LED  [0805_LED]
D13  LED  [0805_LED]
D14  LED  [0805_LED]
D15  LED  [0805_LED]
J1  JTAG  [IDC10]
P9  Header 12  [HDR1X12]
R74  0  [0603]
R75  0  [0603]
R76  1001  [0603]
R77  1001  [0603]
R78  1001  [0603]
R79  1002  [0603]
R80  1002  [0402]
R81  1002  [0603]
R82  1002  [0402]
R83  1002  [0402]
R84  1002  [0402]
R85  25R0  [0603]
R88  value 4.7K  [0603]  (hidden comment: Res2)
R129  value 4.7K  [0603]  (hidden comment: Res2)
R130  value 4.7K  [0603]  (hidden comment: Res2)
R131  value 4.7K  [0603]  (hidden comment: Res2)
R132  value 4.7K  [0603]  (hidden comment: Res2)
R133  value 4.7K  [0603]  (hidden comment: Res2)
R134  value 4.7K  [0603]  (hidden comment: Res2)
R135  value 4.7K  [0603]  (hidden comment: Res2)
T12  (no value)  [TEST]
T14  (no value)  [TEST]
T15  (no value)  [TEST]
T16  (no value)  [TEST]
U18  EP4CE75F23I7  [FBGA484]  (parts A,B,C,D,E,F,G,H,I,J,K,L,M of 13)
U19  50MHz  [CLOCK4]
U20  EPCS16SI8N  [SO8]

### Nets
DGND: C39.1 C40.1 C41.1 C42.1 C43.1 C44.1 J1.2 J1.10 R78.1 R79.1 R80.2 U18.A1(GND) U18.A22(GND) U18.AA2(GND) U18.AA22(GND) U18.AB1(GND) U18.AB22(GND) U18.C5(GND) U18.C9(GND) U18.C11(GND) U18.C12(GND) U18.C14(GND) U18.C16(GND) U18.D3(GND) U18.E10(GND) U18.E18(GNDA2) U18.E20(GND) U18.F3(GND) U18.F5(GNDA3) U18.F12(GND) U18.F16(GND) U18.G2(GND) U18.G9(GND) U18.G11(GND) U18.G13(GND) U18.G15(GND) U18.G17(GND) U18.G20(GND) U18.H8(GND) U18.H10(GND) U18.H12(GND) U18.H13(GND) U18.H14(GND) U18.H16(GND) U18.J9(GND) U18.J15(GND) U18.K3(GND) U18.K7(GND) U18.K10(GND) U18.K11(GND) U18.K12(GND) U18.K13(GND) U18.K16(GND) U18.L8(GND) U18.L10(GND) U18.L11(GND) U18.L12(GND) U18.L13(GND) U18.L15(GND) U18.L20(GND) U18.M7(GND) U18.M10(GND) U18.M11(GND) U18.M12(GND) U18.M13(GND) U18.N3(GND) U18.N8(GND) U18.N10(GND) U18.N11(GND) U18.N12(GND) U18.N13(GND) U18.N15(GND) U18.N17(GND) U18.P6(GND) U18.P8(GND) U18.P16(GND) U18.P19(GND) U18.R7(GND) U18.R9(GND) U18.R11(GND) U18.R13(GND) U18.T8(GND) U18.T10(GND) U18.T12(GND) U18.T14(GND) U18.U3(GND) U18.U5(GNDA1) U18.U7(GND) U18.U13(GND) U18.V6(GND) U18.V18(GNDA4) U18.V20(GND) U18.W3(GND) U18.Y5(GND) U18.Y9(GND) U18.Y11(GND) U18.Y12(GND) U18.Y16(GND) U18.Y18(GND) U18.Y20(GND) U19.2(GND) U20.4(GND)
+1.2V: U18.E17(VCCD_PLL2) U18.F6(VCCD_PLL3) U18.G8(VCCINT) U18.G10(VCCINT) U18.G12(VCCINT) U18.G14(VCCINT) U18.G16(VCCINT) U18.H9(VCCINT) U18.H11(VCCINT) U18.H15(VCCINT) U18.J7(VCCINT) U18.J8(VCCINT) U18.J10(VCCINT) U18.J11(VCCINT) U18.J12(VCCINT) U18.J13(VCCINT) U18.J14(VCCINT) U18.J16(VCCINT) U18.J17(VCCINT) U18.K8(VCCINT) U18.K9(VCCINT) U18.K14(VCCINT) U18.K15(VCCINT) U18.K17(VCCINT) U18.L7(VCCINT) U18.L9(VCCINT) U18.L14(VCCINT) U18.L16(VCCINT) U18.M8(VCCINT) U18.M9(VCCINT) U18.M14(VCCINT) U18.M15(VCCINT) U18.N7(VCCINT) U18.N9(VCCINT) U18.N14(VCCINT) U18.N16(VCCINT) U18.P7(VCCINT) U18.P9(VCCINT) U18.P10(VCCINT) U18.P11(VCCINT) U18.P12(VCCINT) U18.P13(VCCINT) U18.P14(VCCINT) U18.P15(VCCINT) U18.P17(VCCINT) U18.R6(VCCINT) U18.R8(VCCINT) U18.R10(VCCINT) U18.R12(VCCINT) U18.R15(VCCINT) U18.T7(VCCINT) U18.T9(VCCINT) U18.T11(VCCINT) U18.T13(VCCINT) U18.U6(VCCD_PLL1) U18.U8(VCCINT) U18.V7(VCCINT) U18.V17(VCCD_PLL4)
+2.5V: R75.1 U18.F18(VCCA2) U18.G6(VCCA3) U18.T6(VCCA1) U18.U18(VCCA4)
+3.3V: C39.2 C40.2 J1.6 R81.1 R82.1 R83.2 R84.2 R88.2 R129.2 R130.2 R131.2 R132.2 R133.2 R134.2 R135.2 U18.A2(VCCIO8) U18.A21(VCCIO7) U18.AB2(VCCIO3) U18.AB21(VCCIO4) U18.D4(VCCIO1) U18.D5(VCCIO8) U18.D9(VCCIO8) U18.D11(VCCIO8) U18.D12(VCCIO7) U18.D14(VCCIO7) U18.D16(VCCIO7) U18.E19(VCCIO6) U18.F4(VCCIO1) U18.G19(VCCIO6) U18.K4(VCCIO1) U18.L19(VCCIO6) U18.N4(VCCIO2) U18.P18(VCCIO5) U18.U4(VCCIO2) U18.V19(VCCIO5) U18.W4(VCCIO2) U18.W5(VCCIO3) U18.W9(VCCIO3) U18.W11(VCCIO3) U18.W12(VCCIO4) U18.W16(VCCIO4) U18.W18(VCCIO4) U18.Y19(VCCIO5) U19.4(VCC) U20.3(VCC) U20.7(VCC) U20.8(VCC)
CMD_BUS: U18.D20(IO,_VREFB6N0)
DIN_1A: U18.E14(IO,_DIFFIO_T33n,_(PADD3),_(DQ4T)/(DQ5T)/(DQ5T))
DIN_2A: U18.E13(IO,_VREFB7N2)
DIN_3A: U18.E11(IO,_DIFFIO_T25n,_(PADD13))
DOUT_1A: U18.C15(IO,_VREFB7N1)
DOUT_2A: U18.D13(IO,_DIFFIO_T31p,_(PADD8),_(DQ4T)/(DQ5T)/(DQ5T))
DOUT_3A: U18.E12(IO,_(_)/(DQ5T)/(DQ5T))
FPGA_ASDO: C44.2 U18.H6(IO,_DIFFIO_L6p,_(DQ2L)/(DQ1L)/(DQ1L)) U20.5(ASDI)
FPGA_CONF_DONE: R82.2 U18.M18(CONF_DONE)
FPGA_DATA0: R85.1 U18.K1(IO,_(DATA0))
FPGA_DCLK: C42.2 U18.K2(DCLK) U20.6(DCLK)
FPGA_LED1: D15.2(K) U18.AB18(IO,_(DQ2B)/(DQ5B)/(DQ5B))
FPGA_LED2: D14.2(K) U18.AA17(IO,_DIFFIO_B39p)
FPGA_LED3: D13.2(K) U18.AB17(IO,_DIFFIO_B39n)
FPGA_LED4: D12.2(K) U18.AA18(IO,_VREFB4N1)
FPGA_LED5: D11.2(K) U18.AA19(IO,_RUP2)
FPGA_LED6: D10.2(K) U18.AB19(IO,_RDN2)
FPGA_LED7: D9.2(K) U18.W17(IO,_DIFFIO_B40p,_(DQ2B)/(DQ5B)/(DQ5B))
FPGA_LED8: D1.2(K) U18.Y17(IO,_DIFFIO_B40n,_(DQS0B/CQ1B,CDPCLK3)/(DQS0B/CQ1B,CDPCLK3)/(DQS0B/CQ1B,CDPCLK3))
FPGA_nCE: R80.1 U18.L3(nCE)
FPGA_nCONFIG: R83.1 U18.K5(nCONFIG)
FPGA_nCSO: C43.2 U18.E2(IO,_DIFFIO_L8p,_(FLASH_nCE,nCSO)) U20.1(nCS)
FPGA_nSTATUS: R84.1 U18.K6(nSTATUS)
FPGA_TCK: J1.1 R78.2 U18.L2(TCK)
FPGA_TDI: J1.9 R77.1 U18.L5(TDI)
FPGA_TDO: J1.3 U18.L4(TDO)
FPGA_TEST1: P9.1 U18.J22(IO,_DIFFIO_R18n,_(DQS0R/CQ1R,DPCLK7)/(DQS0R/CQ1R,DPCLK7)/(DQS0R/CQ1R,DPCLK7))
FPGA_TEST2: P9.2 U18.H22(IO,_DIFFIO_R17n,_(DQ0R)/(DQ1R)/(DQ1R))
FPGA_TEST3: P9.3 U18.H21(IO,_DIFFIO_R17p,_(DQ0R)/(DQ1R)/(DQ1R))
FPGA_TEST4: P9.4 U18.K18(IO,_DIFFIO_R16n,_(DQ0R)/(DQ1R)/(DQ1R))
FPGA_TEST5: P9.5 U18.J18(IO,_DIFFIO_R16p)
FPGA_TEST6: P9.6 U18.F22(IO,_DIFFIO_R14n,_(DQ0R)/(DQ1R)/(DQ1R))
FPGA_TEST7: P9.7 U18.F21(IO,_DIFFIO_R14p,_(DQ0R)/(DQ1R)/(DQ1R))
FPGA_TEST8: P9.8 U18.J20(IO,_DIFFIO_R13n)
FPGA_TEST9: P9.9 U18.J19(IO,_DIFFIO_R13p)
FPGA_TEST10: P9.10 U18.H20(IO,_DIFFIO_R12n,_(DQ0R)/(DQ1R)/(DQ1R))
FPGA_TEST11: P9.11 U18.H19(IO,_DIFFIO_R12p,_(DQ0R)/(DQ1R)/(DQ1R))
FPGA_TEST12: P9.12 U18.E22(IO,_DIFFIO_R11n,_(nWE),_(DQ0R)/(DQ1R)/(DQ1R))
FPGA_TMS: J1.5 R76.1 U18.L1(TMS)
GPS_Timer: U18.F17(IO,_DIFFIO_R1n,_(DQ2R)/(DQ1R)/(DQ1R))
Main_Data: U18.C20(IO,_DIFFIO_R4n,_(PADD20),_(DQS2R/CQ3R,CDPCLK5)/(DQS2R/CQ3R,CDPCLK5)/(DQS2R/CQ3R,CDPCLK5))
Main_Data_RxEN: U18.B22(IO,_DIFFIO_R5n,_(PADD22),_(DQ2R)/(DQ1R)/(DQ1R))
Main_Data_TxEN: U18.B21(IO,_DIFFIO_R5p,_(PADD21),_(DQ2R)/(DQ1R)/(DQ1R))
MCLK_A: U18.K22(IO,_DIFFIO_R19n,_(nCEO))
MCLK_B: U18.K19(IO,_VREFB6N2)
MCLK_C: U18.L21(IO,_DIFFIO_R20p,_(CRC_ERROR))
MCU_FPGA_BAK1: U18.E8(IO,_DIFFIO_T14p)
MCU_FPGA_BAK2: U18.A5(IO,_DIFFIO_T13p,_(DATA5),_(DQ3T)/(DQ3T)/(DQ5T))
MCU_FPGA_BAK3: U18.B5(IO,_VREFB8N1)
MCU_FPGA_BAK4: U18.F10(IO,_DIFFIO_T12p,_(DATA6),_(DQ3T)/(DQ3T)/(DQ5T))
MCU_FPGA_BAK5: U18.C6(IO,_DIFFIO_T11n,_(DATA7),_(DQ3T)/(DQ3T)/(DQ5T))
MCU_FPGA_BAK6: U18.D7(IO,_DIFFIO_T11p)
MSEL0: R79.2 U18.K20(MSEL3) U18.L17(MSEL2) U18.M17(MSEL0)
MSEL1: R81.2 U18.L18(MSEL1)
SCLK_1A: U18.F13(IO,_DIFFIO_T33p,_(PADD4),_(DQS2T/CQ3T,DPCLK8)/(DQS2T/CQ3T,DPCLK8)/(DQS2T/CQ3T,DPCLK8))
SCLK_2A: U18.A14(IO,_DIFFIO_T27n,_(PADD9),_(DQ4T)/(DQ5T)/(DQ5T))
SCLK_3A: U18.F11(IO,_DIFFIO_T25p,_(PADD14),_(DM4T)/(DM5T/BWS#5T)/(DM5T/BWS#5T))
SPI1_MISO: U18.E6(IO,_PLL3_CLKOUTn)
SPI1_MOSI: U18.E5(IO,_PLL3_CLKOUTp)
SPI1_NSS: U18.G7(IO,_DIFFIO_T2p)
SPI1_SCK: U18.F9(IO)
SYNC_1A: U18.B16(IO,_DIFFIO_T35p,_(DQ4T)/(DQ5T)/(DQ5T))
SYNC_2A: U18.C13(IO,_DIFFIO_T31n,_(PADD7))
SYNC_3A: U18.B13(IO,_DIFFIO_T26p,_(PADD12),_(DQS4T/CQ5T,DPCLK9)/(DQS4T/CQ5T,DPCLK9)/(DQS4T/CQ5T,DPCLK9))
NetC41_2: C41.2 R85.2 U20.2(DATA)
NetD1_1: D1.1(A) R88.1
NetD9_1: D9.1(A) R129.1
NetD10_1: D10.1(A) R130.1
NetD11_1: D11.1(A) R131.1
NetD12_1: D12.1(A) R132.1
NetD13_1: D13.1(A) R133.1
NetD14_1: D14.1(A) R134.1
NetD15_1: D15.1(A) R135.1
NetJ1_4: J1.4 R75.2 R76.2 R77.2
NetR74_1: R74.1 U19.3(OUT)
NetR74_2: R74.2 U18.AB12(CLK12,_DIFFCLK_7n)
NetT12_1: T12.1(TEST) U18.N19(IO,_VREFB5N0)
NetT14_1: T14.1(TEST) U18.AB11(CLK14,_DIFFCLK_6n)
NetT15_1: T15.1(TEST) U18.P20(IO,_VREFB5N1)
NetT16_1: T16.1(TEST) U18.AA11(CLK15,_DIFFCLK_6p)

Not connected (* = marked no-connect by the designer): J1 7* 8*; U18 A3(IO,_DIFFIO_T7n,_(DATA10),_(DQ3T)/(DQ3T)/(DQ5T)) A4(IO,_DIFFIO_T10n,_(DQ3T)/(DQ3T)/(DQ5T)) A6(IO,_DIFFIO_T17n,_(PADD19),_(DQ5T)/(DQ3T)/(DQ5T)) A7(IO,_DIFFIO_T18n,_(PADD18),_(DQ5T)/(DQ3T)/(DQ5T)) A8(IO,_DIFFIO_T19n,_(DATA2),_(DQ5T)/(DQ3T)/(DQ5T)) A9(IO,_DIFFIO_T22n,_(PADD16),_(DQ5T)/(DQ3T)/(DQ5T)) A10(IO,_DIFFIO_T23n,_(DQ5T)/(DQ3T)/(DQ5T)) A11(CLK10,_DIFFCLK_4n) A12(CLK8,_DIFFCLK_5n) A13(IO,_DIFFIO_T26n,_(PADD11),_(DQ4T)/(DQ5T)/(DQ5T)) A15(IO,_DIFFIO_T32n,_(PADD5),_(DQ4T)/(DQ5T)/(DQ5T)) A16(IO,_DIFFIO_T35n,_(DM2T)/(DM5T/BWS#5T)/(DM5T/BWS#5T)) A17(IO,_DIFFIO_T36n,_(PADD1),_(DQ2T)/(DQ5T)/(DQ5T)) A18(IO,_DIFFIO_T39n,_(DQ2T)/(DQ5T)/(DQ5T)) A19(IO,_RDN4) A20(IO,_PLL2_CLKOUTn) AA1(IO,_DIFFIO_L33n,_(DQ3L)/(DQ3L)/(DQ1L)) AA3(IO,_PLL1_CLKOUTp) AA4(IO,_(DQ3B)/(DQ3B)/(DQ5B)) AA5(IO,_DIFFIO_B5p,_(DQ3B)/(DQ3B)/(DQ5B)) AA6(IO,_DIFFIO_B5n) AA7(IO,_DIFFIO_B10p,_(DM5B/BWS#5B)/(DM3B/BWS#3B)/(DM5B/BWS#5B)) AA8(IO,_DIFFIO_B17p,_(DQ5B)/(DQ3B)/(DQ5B)) AA9(IO,_DIFFIO_B18p,_(DQ5B)/(DQ3B)/(DQ5B)) AA10(IO,_DIFFIO_B23p,_(DM4B)/(DM5B/BWS#5B)/(DM5B/BWS#5B)) AA12(CLK13,_DIFFCLK_7p) AA13(IO,_DIFFIO_B25p,_(DQ4B)/(DQ5B)/(DQ5B)) AA14(IO,_DIFFIO_B27p,_(DQ4B)/(DQ5B)/(DQ5B)) AA15(IO,_DIFFIO_B29p,_(DQ4B)/(DQ5B)/(DQ5B)) AA16(IO,_DIFFIO_B32p,_(DM2B)/(DM5B/BWS#5B)/(DM5B/BWS#5B)) AA20(IO,_DIFFIO_B41p,_(_)/(DQ5B)/(DQ5B)) AA21(IO,_DIFFIO_R41p,_(DM3R/BWS#3R)/(DM3R/BWS#3R)/(DM1R/BWS#1R)) AB3(IO,_PLL1_CLKOUTn) AB4(IO,_VREFB3N2) AB5(IO,_DIFFIO_B6n) AB6(IO,_DIFFIO_B6p) AB7(IO,_DIFFIO_B10n,_(DQ5B)/(DQ3B)/(DQ5B)) AB8(IO,_DIFFIO_B17n,_(DQ5B)/(DQ3B)/(DQ5B)) AB9(IO,_DIFFIO_B18n,_(DQS5B/CQ5B#,DPCLK3)/(DQS5B/CQ5B#,DPCLK3)/(DQS5B/CQ5B#,DPCLK3)) AB10(IO,_DIFFIO_B23n,_(_)/(DQ5B)/(DQ5B)) AB13(IO,_DIFFIO_B25n,_(DQ4B)/(DQ5B)/(DQ5B)) AB14(IO,_DIFFIO_B27n,_(DQ4B)/(DQ5B)/(DQ5B)) AB15(IO,_DIFFIO_B29n,_(DQ4B)/(DQ5B)/(DQ5B)) AB16(IO,_DIFFIO_B32n,_(DQ2B)/(DQ5B)/(DQ5B)) AB20(IO,_DIFFIO_B41n,_(DQ2B)/(DQ5B)/(DQ5B)) B1(IO,_DIFFIO_L2n,_(DQ2L)/(DQ1L)/(DQ1L)) B2(IO,_DIFFIO_L2p,_(DQ2L)/(DQ1L)/(DQ1L)) B3(IO,_DIFFIO_T7p,_(DATA11),_(DQ3T)/(DQ3T)/(DQ5T)) B4(IO,_DIFFIO_T10p,_(DATA8),_(DQ3T)/(DQ3T)/(DQ5T)) B6(IO,_DIFFIO_T17p,_(DATA15),_(DQ5T)/(DQ3T)/(DQ5T)) B7(IO,_DIFFIO_T18p,_(DATA4),_(DQ5T)/(DQ3T)/(DQ5T)) B8(IO,_DIFFIO_T19p,_(DATA3),_(DQ5T)/(DQ3T)/(DQ5T)) B9(IO,_DIFFIO_T22p,_(PADD17),_(DQS5T/CQ5T#,DPCLK10)/(DQS5T/CQ5T#,DPCLK10)/(DQS5T/CQ5T#,DPCLK10)) B10(IO,_DIFFIO_T23p,_(PADD15)) B11(CLK11,_DIFFCLK_4p) B12(CLK9,_DIFFCLK_5p) B14(IO,_DIFFIO_T27p,_(PADD10),_(DQ4T)/(DQ5T)/(DQ5T)) B15(IO,_DIFFIO_T32p,_(PADD6),_(DQ4T)/(DQ5T)/(DQ5T)) B17(IO,_DIFFIO_T36p,_(PADD2),_(_)/(DQ5T)/(DQ5T)) B18(IO,_DIFFIO_T39p,_(PADD0)) B19(IO,_RUP4) B20(IO,_PLL2_CLKOUTp) C1(IO,_DIFFIO_L4n,_(DQ2L)/(DQ1L)/(DQ1L)) C2(IO,_DIFFIO_L4p,_(DQS2L/CQ3L,CDPCLK0)/(DQS2L/CQ3L,CDPCLK0)/(DQS2L/CQ3L,CDPCLK0)) C3(IO,_DIFFIO_T3n,_(DQ3T)/(DQ3T)/(DQ5T)) C4(IO,_DIFFIO_T3p,_(DATA12),_(DQS1T/CQ1T#,CDPCLK7)/(DQS1T/CQ1T#,CDPCLK7)/(DQS1T/CQ1T#,CDPCLK7)) C7(IO,_DIFFIO_T15p,_(DATA13),_(DM5T/BWS#5T)/(DM3T/BWS#3T)/(DM5T/BWS#5T)) C8(IO,_DIFFIO_T15n,_(DATA14),_(DQS3T/CQ3T#,DPCLK11)/(DQS3T/CQ3T#,DPCLK11)/(DQS3T/CQ3T#,DPCLK11)) C10(IO,_VREFB8N0) C17(IO,_DIFFIO_T40p,_(DQ2T)/(DQ5T)/(DQ5T)) C18(IO,_DIFFIO_T44n) C19(IO,_DIFFIO_T42n,_(DQ2T)/(DQ5T)/(DQ5T)) C21(IO,_DIFFIO_R6p,_(DQ2R)/(DQ1R)/(DQ1R)) C22(IO,_DIFFIO_R6n,_(DQ2R)/(DQ1R)/(DQ1R)) D1(IO,_DIFFIO_L5n,_(DATA1,ASDO)) D2(IO,_DIFFIO_L5p,_(DQ2L)/(DQ1L)/(DQ1L)) D6(IO,_VREFB8N2) D8(IO,_DIFFIO_T14n) D10(IO,_DIFFIO_T24n,_(DQ5T)/(DQ3T)/(DQ5T)) D15(IO,_DIFFIO_T38n) D17(IO,_VREFB7N0) D18(IO,_DIFFIO_T44p) D19(IO,_DIFFIO_T42p,_(DQ2T)/(DQ5T)/(DQ5T)) D21(IO,_DIFFIO_R10p,_(_)/(DQ1R)/(DQ1R)) D22(IO,_DIFFIO_R10n,_(DM2R)/(DM1R/BWS#1R)/(DM1R/BWS#1R)) E1(IO,_DIFFIO_L8n,_(_)/(DQ1L)/(DQ1L)) E3(IO,_DIFFIO_L3n,_(DQ2L)/(DQ1L)/(DQ1L)) E4(IO,_DIFFIO_L3p,_(nRESET),_(DQ2L)/(DQ1L)/(DQ1L)) E7(IO,_DIFFIO_T6n) E9(IO,_DIFFIO_T16n) E15(IO,_DIFFIO_T38p,_(DQ2T)/(DQ5T)/(DQ5T)) E16(IO,_DIFFIO_T46n,_(DQ2T)/(DQ5T)/(DQ5T)) E21(IO,_DIFFIO_R11p,_(nOE),_(_)/(DQ1R)/(DQ1R)) F1(IO,_DIFFIO_L9n,_(DQ0L)/(DQ1L)/(DQ1L)) F2(IO,_DIFFIO_L9p,_(DM2L)/(DM1L/BWS#1L)/(DM1L/BWS#1L)) F7(IO,_DIFFIO_T2n,_(DM3T/BWS#3T)/(DM3T/BWS#3T)/(DM5T/BWS#5T)) F8(IO,_DIFFIO_T9n,_(DATA9),_(DQ3T)/(DQ3T)/(DQ5T)) F14(IO,_DIFFIO_T45p,_(DQS0T/CQ1T,CDPCLK6)/(DQS0T/CQ1T,CDPCLK6)/(DQS0T/CQ1T,CDPCLK6)) F15(IO,_DIFFIO_T46p,_(DQ2T)/(DQ5T)/(DQ5T)) F19(IO,_DIFFIO_R9p,_(DQ2R)/(DQ1R)/(DQ1R)) F20(IO,_DIFFIO_R9n,_(nAVD),_(DQ2R)/(DQ1R)/(DQ1R)) G1(CLK1,_DIFFCLK_0n) G3(IO,_DIFFIO_L1n) G4(IO,_DIFFIO_L1p) G5(IO,_VREFB1N0) G18(IO,_DIFFIO_R8n,_(PADD23),_(DQ2R)/(DQ1R)/(DQ1R)) G21(CLK4,_DIFFCLK_2p) G22(CLK5,_DIFFCLK_2n) H1(IO,_DIFFIO_L13n,_(DQ0L)/(DQ1L)/(DQ1L)) H2(IO,_DIFFIO_L13p,_(DQ0L)/(DQ1L)/(DQ1L)) H3(IO,_DIFFIO_L7n) H4(IO,_DIFFIO_L7p) H5(IO,_VREFB1N1) H7(IO) H17(IO,_DIFFIO_R8p) H18(IO,_VREFB6N1) J1(IO,_DIFFIO_L17n,_(DQ0L)/(DQ1L)/(DQ1L)) J2(IO,_DIFFIO_L17p,_(DQ0L)/(DQ1L)/(DQ1L)) J3(IO,_VREFB1N2) J4(IO,_DIFFIO_L12p,_(DQS0L/CQ1L,DPCLK0)/(DQS0L/CQ1L,DPCLK0)/(DQS0L/CQ1L,DPCLK0)) J5(IO) J6(IO,_DIFFIO_L6n,_(DQ2L)/(DQ1L)/(DQ1L)) J21(IO,_DIFFIO_R18p,_(DM0R)/(DM1R/BWS#1R)/(DM1R/BWS#1R)) K21(IO,_DIFFIO_R19p,_(CLKUSR)) L6(IO,_DIFFIO_L19p,_(DQ0L)/(DQ1L)/(DQ1L)) L22(IO,_DIFFIO_R20n,_(INIT_DONE)) M1(IO,_DIFFIO_L20n,_(_)/(DQ1L)/(DQ1L)) M2(IO,_DIFFIO_L20p,_(DQ0L)/(DQ1L)/(DQ1L)) M3(IO,_DIFFIO_L21n,_(DQ1L)/(DQ3L)/(DQ1L)) M4(IO,_DIFFIO_L21p,_(DM0L)/(DM1L/BWS#1L)/(DM1L/BWS#1L)) M5(IO,_VREFB2N0) M6(IO,_DIFFIO_L19n,_(DQ0L)/(DQ1L)/(DQ1L)) M16(IO) M19(IO,_DIFFIO_R21p,_(DQ1R)/(DQ3R)/(DQ1R)) M20(IO,_DIFFIO_R21n,_(DQ1R)/(DQ3R)/(DQ1R)) M21(IO,_DIFFIO_R22p,_(DQ1R)/(DQ3R)/(DQ1R)) M22(IO,_DIFFIO_R22n,_(DQ1R)/(DQ3R)/(DQ1R)) N1(IO,_DIFFIO_L22n,_(DQ1L)/(DQ3L)/(DQ1L)) N2(IO,_DIFFIO_L22p,_(DQ1L)/(DQ3L)/(DQ1L)) N5(IO,_DIFFIO_L25n,_(DQ1L)/(DQ3L)/(DQ1L)) N6(IO,_DIFFIO_L29n,_(DQ3L)/(DQ3L)/(DQ1L)) N18(IO,_DIFFIO_R24p,_(DQS1R/CQ1R#,DPCLK6)/(DQS1R/CQ1R#,DPCLK6)/(DQS1R/CQ1R#,DPCLK6)) N20(IO,_DIFFIO_R25n,_(DQ1R)/(DQ3R)/(DQ1R)) N21(IO,_DIFFIO_R23p,_(DEV_CLRn)) N22(IO,_DIFFIO_R23n,_(DEV_OE)) P1(IO,_DIFFIO_L23n,_(DQ1L)/(DQ3L)/(DQ1L)) P2(IO,_DIFFIO_L23p,_(DQ1L)/(DQ3L)/(DQ1L)) P3(IO,_DIFFIO_L26n,_(DQ1L)/(DQ3L)/(DQ1L)) P4(IO,_DIFFIO_L26p,_(DQS1L/CQ1L#,DPCLK1)/(DQS1L/CQ1L#,DPCLK1)/(DQS1L/CQ1L#,DPCLK1)) P5(IO,_DIFFIO_L29p) P21(IO,_DIFFIO_R27p,_(DQ1R)/(DQ3R)/(DQ1R)) P22(IO,_DIFFIO_R27n,_(DQ1R)/(DQ3R)/(DQ1R)) R1(IO,_DIFFIO_L24n,_(DQ1L)/(DQ3L)/(DQ1L)) R2(IO,_DIFFIO_L24p,_(DQ1L)/(DQ3L)/(DQ1L)) R3(IO,_DIFFIO_L30n) R4(IO,_DIFFIO_L30p) R5(IO,_VREFB2N2) R14(IO,_DIFFIO_B45p) R16(IO,_PLL4_CLKOUTn) R17(IO,_DIFFIO_R35n) R18(IO,_DIFFIO_R31n) R19(IO,_DIFFIO_R31p,_(DM1R/BWS#1R)/(DM3R/BWS#3R)/(DM1R/BWS#1R)) R20(IO,_DIFFIO_R33n,_(DQ3R)/(DQ3R)/(DQ1R)) R21(IO,_DIFFIO_R29p,_(DQ1R)/(DQ3R)/(DQ1R)) R22(IO,_DIFFIO_R29n,_(DQ1R)/(DQ3R)/(DQ1R)) T1(CLK3,_DIFFCLK_1n) T2(CLK2,_DIFFCLK_1p) T3(IO,_VREFB2N1) T4(IO,_DIFFIO_L35p,_(DQS3L/CQ3L#,CDPCLK1)/(DQS3L/CQ3L#,CDPCLK1)/(DQS3L/CQ3L#,CDPCLK1)) T5(IO,_DIFFIO_L35n,_(DM3L/BWS#3L)/(DM3L/BWS#3L)/(DM1L/BWS#1L)) T15(IO,_DIFFIO_B38n,_(DQ2B)/(DQ5B)/(DQ5B)) T16(IO,_PLL4_CLKOUTp) T17(IO,_RUP3) T18(IO,_RDN3) T19(IO,_DIFFIO_R36p) T20(IO,_DIFFIO_R36n) T21(CLK6,_DIFFCLK_3p) T22(CLK7,_DIFFCLK_3n) U1(IO,_DIFFIO_L27n,_(DQ3L)/(DQ3L)/(DQ1L)) U2(IO,_DIFFIO_L27p,_(DM1L/BWS#1L)/(DM3L/BWS#3L)/(DM1L/BWS#1L)) U9(IO,_DIFFIO_B8p,_(DQ3B)/(DQ3B)/(DQ5B)) U10(IO,_DIFFIO_B16n,_(DQ5B)/(DQ3B)/(DQ5B)) U11(IO,_VREFB3N0) U12(IO,_DIFFIO_B30p,_(DQ4B)/(DQ5B)/(DQ5B)) U14(IO,_DIFFIO_B35n) U15(IO,_DIFFIO_B36p) U16(IO,_DIFFIO_B44p) U17(IO,_DIFFIO_B44n) U19(IO,_DIFFIO_R39p) U20(IO,_DIFFIO_R39n,_(DQ3R)/(DQ3R)/(DQ1R)) U21(IO,_DIFFIO_R32p,_(DQ3R)/(DQ3R)/(DQ1R)) U22(IO,_DIFFIO_R32n,_(DQ3R)/(DQ3R)/(DQ1R)) V1(IO,_DIFFIO_L28n,_(DQ3L)/(DQ3L)/(DQ1L)) V2(IO,_DIFFIO_L28p,_(DQ3L)/(DQ3L)/(DQ1L)) V3(IO,_RDN1) V4(IO,_RUP1) V5(IO,_DIFFIO_B1n,_(DM3B/BWS#3B)/(DM3B/BWS#3B)/(DM5B/BWS#5B)) V8(IO,_DIFFIO_B8n,_(DQ3B)/(DQ3B)/(DQ5B)) V9(IO,_VREFB3N1) V10(IO,_DIFFIO_B15p,_(DQS3B/CQ3B#,DPCLK2)/(DQS3B/CQ3B#,DPCLK2)/(DQS3B/CQ3B#,DPCLK2)) V11(IO,_(DQ5B)/(DQ3B)/(DQ5B)) V12(IO,_VREFB4N2) V13(IO,_DIFFIO_B33p,_(DQS2B/CQ3B,DPCLK5)/(DQS2B/CQ3B,DPCLK5)/(DQS2B/CQ3B,DPCLK5)) V14(IO,_DIFFIO_B35p,_(DQ2B)/(DQ5B)/(DQ5B)) V15(IO,_DIFFIO_B36n,_(DQ2B)/(DQ5B)/(DQ5B)) V16(IO,_VREFB4N0) V21(IO,_DIFFIO_R34p,_(DQ3R)/(DQ3R)/(DQ1R)) V22(IO,_DIFFIO_R34n,_(DQ3R)/(DQ3R)/(DQ1R)) W1(IO,_DIFFIO_L31n,_(DQ3L)/(DQ3L)/(DQ1L)) W2(IO,_DIFFIO_L31p,_(DQ3L)/(DQ3L)/(DQ1L)) W6(IO,_DIFFIO_B4p,_(DQ3B)/(DQ3B)/(DQ5B)) W7(IO,_DIFFIO_B7p,_(DQ3B)/(DQ3B)/(DQ5B)) W8(IO,_(DQ3B)/(DQ3B)/(DQ5B)) W10(IO,_DIFFIO_B22p,_(DQ5B)/(DQ3B)/(DQ5B)) W13(IO,_DIFFIO_B28p,_(DQ4B)/(DQ5B)/(DQ5B)) W14(IO,_DIFFIO_B33n) W15(IO,_DIFFIO_B37p,_(DQ2B)/(DQ5B)/(DQ5B)) W19(IO,_VREFB5N2) W20(IO,_(DQS3R/CQ3R#,CDPCLK4)/(DQS3R/CQ3R#,CDPCLK4)/(DQS3R/CQ3R#,CDPCLK4)) W21(IO,_DIFFIO_R37p,_(DQ3R)/(DQ3R)/(DQ1R)) W22(IO,_DIFFIO_R37n,_(DQ3R)/(DQ3R)/(DQ1R)) Y1(IO,_DIFFIO_L32n,_(DQ3L)/(DQ3L)/(DQ1L)) Y2(IO,_DIFFIO_L32p,_(DQ3L)/(DQ3L)/(DQ1L)) Y3(IO,_DIFFIO_B3n,_(DQ3B)/(DQ3B)/(DQ5B)) Y4(IO,_DIFFIO_B3p) Y6(IO,_(DQS1B/CQ1B#,CDPCLK2)/(DQS1B/CQ1B#,CDPCLK2)/(DQS1B/CQ1B#,CDPCLK2)) Y7(IO,_DIFFIO_B7n,_(DQ3B)/(DQ3B)/(DQ5B)) Y8(IO,_DIFFIO_B11p,_(DQ5B)/(DQ3B)/(DQ5B)) Y10(IO,_DIFFIO_B22n,_(DQ5B)/(DQ3B)/(DQ5B)) Y13(IO,_DIFFIO_B28n,_(DQS4B/CQ5B,DPCLK4)/(DQS4B/CQ5B,DPCLK4)/(DQS4B/CQ5B,DPCLK4)) Y14(IO,_DIFFIO_B31p) Y15(IO,_DIFFIO_B31n) Y21(IO,_DIFFIO_R40p) Y22(IO,_DIFFIO_R40n,_(DQ3R)/(DQ3R)/(DQ1R)); U19 1(NC)

### Notes on the sheet
- ADC1接口
- ADC2接口
- ADC3接口
- FPGA主时钟
- FPGA电源控制电路
- 程序下载、固化控制电路
- 配置芯片
- (in symbol EP4CE75F23I7, part A) BANK 1
- (in symbol EP4CE75F23I7, part B) BANK 2
- (in symbol EP4CE75F23I7, part C) BANK 3
- (in symbol EP4CE75F23I7, part D) BANK 4
- (in symbol EP4CE75F23I7, part E) BANK 5
- (in symbol EP4CE75F23I7, part F) BANK 6
- (in symbol EP4CE75F23I7, part G) BANK 7
- (in symbol EP4CE75F23I7, part H) BANK 8

### Library data of the parts
C39 = CAP: Capacitor
C40-C44 = C
J1 = HEADER 5X2
P9 = Header 12: Header, 12-Pin; LatestRevisionDate: 17-Jul-2002; LatestRevisionNote: Re-released for DXP Platform.; Publisher: Altium Limited
R74-R85 = RES2
R88 R129-R135 = Res2: Resistor; Published: 8-Jun-2000; LatestRevisionDate: 17-Jul-2002; LatestRevisionNote: Re-released for DXP Platform.; PackageReference: AXIAL-0.4; Publisher: Altium Limited
T12 T14-T16 = TEST
U18 = EP4CE75F23I7: Cyclone IV Family FPGA, 2V Core, 292 I/O Pins, 4 PLLs, 484-Pin FBGA, Speed Grade 7, Industrial Grade; Published: 3-May-2010; DatasheetVersion: ver1.2, Mar-2010; PackageVersion: ver16.0, Dec-2009; PackageReference: FBGA484; Publisher: Altium Limited; PackageDescription: 484-Ball FineLine Ball Grid Array (FBGA484) - Flip Chip; Supplier 1: Digi-Key; Supplier Part Number 1: EP4CE75F23I7-ND; Code_JEDEC: MS-034-AAJ-1; Code_IPC: BGA100P22X22-484; ComponentLink1Description: Manufacturer Link; ComponentLink1URL: http://www.altera.com/; ComponentLink2Description: Handbook; ComponentLink2URL: http://www.altera.com/literature/hb/cyclone-iv/cyclone4-handbook.pdf; ComponentLink3Description: Pinout Specification; ComponentLink3URL: http://www.altera.com/literature/lit-dp.jsp?category=cyc%204&showspreadsheet=y; ComponentLink4Description: Packaging Specification; ComponentLink4URL: http://www.altera.com/literature/ds/dspkg.pdf
U19 = OSC
U20 = EPCS4

## Sheet STM32F103RBT6.SchDoc
size A4
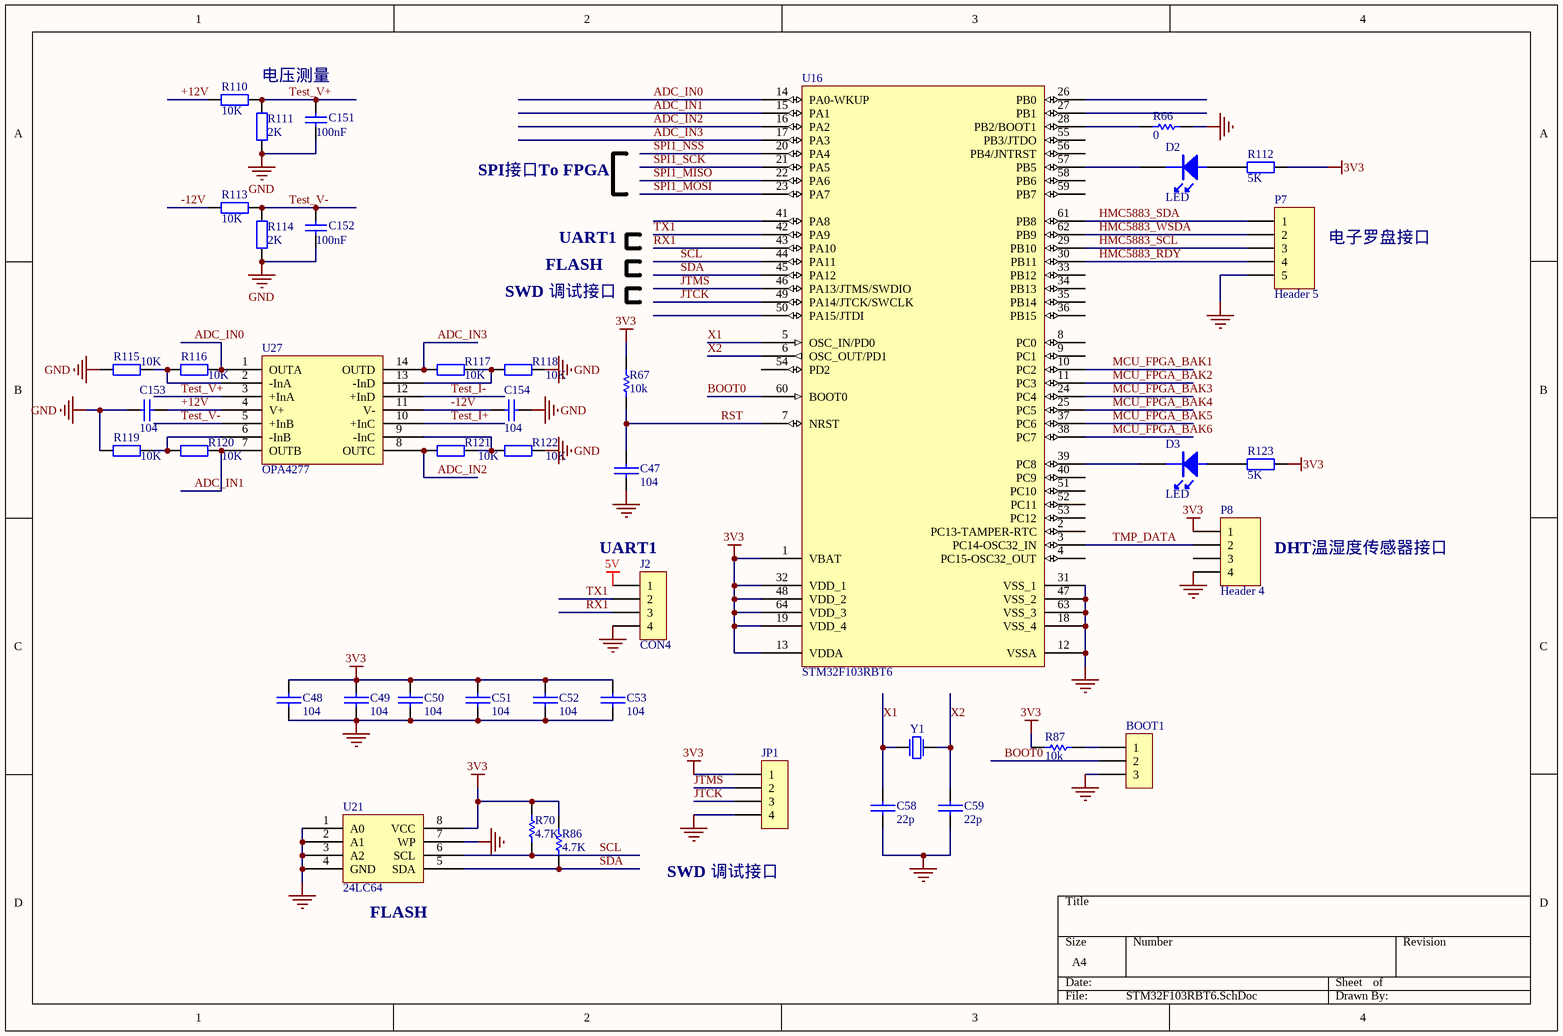
[diagram p10: STM32F103RBT6.SchDoc]

### Parts
BOOT1  (no value)  [HDR1X3]
C47  104  [0603]
C48  104  [0603]
C49  104  [0603]
C50  104  [0603]
C51  104  [0603]
C52  104  [0603]
C53  104  [0603]
C58  22p  [0603]
C59  22p  [0603]
C151  value 100nF  [0603]  (hidden comment: Cap)
C152  value 100nF  [0603]  (hidden comment: Cap)
C153  104  [0603]
C154  104  [0603]
D2  LED  [0805_LED]
D3  LED  [0805_LED]
J2  CON4  [HDR1X4]
JP1  (no value)  [HDR1X4]
P7  Header 5  [HDR1X5]
P8  Header 4  [HDR1X4]
R66  0  [0603]
R67  10k  [0603]
R70  4.7K  [0603]
R86  4.7K  [0603]
R87  10k  [0603]
R110  value 10K  [0603]  (hidden comment: Res2)
R111  value 2K  [0603]  (hidden comment: Res2)
R112  value 5K  [0603]  (hidden comment: Res2)
R113  value 10K  [0603]  (hidden comment: Res2)
R114  value 2K  [0603]  (hidden comment: Res2)
R115  value 10K  [0603]  (hidden comment: Res2)
R116  value 10K  [0603]  (hidden comment: Res2)
R117  value 10K  [0603]  (hidden comment: Res2)
R118  value 10K  [0603]  (hidden comment: Res2)
R119  value 10K  [0603]  (hidden comment: Res2)
R120  value 10K  [0603]  (hidden comment: Res2)
R121  value 10K  [0603]  (hidden comment: Res2)
R122  value 10K  [0603]  (hidden comment: Res2)
R123  value 5K  [0603]  (hidden comment: Res2)
U16  STM32F103RBT6  [LQFP64_M]
U21  24LC64  [SO8]
U27  OPA4277  [SOP14]
Y1  (no value)  [XTAL_8M]

### Nets
3V3: C48.1 C49.1 C50.1 C51.1 C52.1 C53.1 JP1.1 P8.1 R67.2 R70.2 R86.2 R87.1 R112.2 R123.2 U16.1(VBAT) U16.13(VDDA) U16.19(VDD_4) U16.32(VDD_1) U16.48(VDD_2) U16.64(VDD_3) U21.8(VCC)
5V: J2.1
GND: BOOT1.3 C47.2 C48.2 C49.2 C50.2 C51.2 C52.2 C53.2 C58.2 C59.2 C151.1 C152.1 C153.1 C154.2 J2.4 JP1.4 P7.5 P8.4 R66.2 R111.2 R114.2 R115.1 R118.2 R119.1 R122.2 U16.12(VSSA) U16.18(VSS_4) U16.31(VSS_1) U16.47(VSS_2) U16.63(VSS_3) U21.1(A0) U21.2(A1) U21.3(A2) U21.4(GND) U21.7(WP)  [project net DGND]
+12V: C153.2 R110.2 U27.4(V+)
-12V: C154.1 R113.2 U27.11(V-)
ADC_IN0: R116.2 U16.14(PA0-WKUP) U27.1(OUTA)
ADC_IN1: R120.2 U16.15(PA1) U27.7(OUTB)
ADC_IN2: R121.1 U16.16(PA2) U27.8(OUTC)
ADC_IN3: R117.1 U16.17(PA3) U27.14(OUTD)
BOOT0: BOOT1.2 U16.60(BOOT0)
HMC5883_RDY: P7.4 U16.30(PB11)
HMC5883_SCL: P7.3 U16.29(PB10)
HMC5883_SDA: P7.1 U16.61(PB8)
HMC5883_WSDA: P7.2 U16.62(PB9)
JTCK: JP1.3 U16.49(PA14/JTCK/SWCLK)
JTMS: JP1.2 U16.46(PA13/JTMS/SWDIO)
MCU_FPGA_BAK1: U16.10(PC2)
MCU_FPGA_BAK2: U16.11(PC3)
MCU_FPGA_BAK3: U16.24(PC4)
MCU_FPGA_BAK4: U16.25(PC5)
MCU_FPGA_BAK5: U16.37(PC6)
MCU_FPGA_BAK6: U16.38(PC7)
RST: C47.1 R67.1 U16.7(NRST)
RX1: J2.3 U16.43(PA10)
SCL: R70.1 U16.44(PA11) U21.6(SCL)
SDA: R86.1 U16.45(PA12) U21.5(SDA)
SPI1_MISO: U16.22(PA6)
SPI1_MOSI: U16.23(PA7)
SPI1_NSS: U16.20(PA4)
SPI1_SCK: U16.21(PA5)
Test_I+: U27.10(+InC)
Test_I-: U27.12(+InD)
Test_V+: C151.2 R110.1 R111.1 U27.3(+InA)
Test_V-: C152.2 R113.1 R114.1 U27.5(+InB)
TMP_DATA: P8.2 U16.3(PC14-OSC32_IN)
TX1: J2.2 U16.42(PA9)
X1: C58.1 U16.5(OSC_IN/PD0) Y1.2(P2)
X2: C59.1 U16.6(OSC_OUT/PD1) Y1.1(P1)
NetBOOT1_1: BOOT1.1 R87.2
NetD2_1: D2.1(A) R112.1
NetD2_2: D2.2(K) U16.57(PB5)
NetD3_1: D3.1(A) R123.1
NetD3_2: D3.2(K) U16.39(PC8)
NetR66_1: R66.1 U16.28(PB2/BOOT1)
NetR115_2: R115.2 R116.1 U27.2(-InA)
NetR117_2: R117.2 R118.1 U27.13(-InD)
NetR119_2: R119.2 R120.1 U27.6(-InB)
NetR121_2: R121.2 R122.1 U27.9(-InC)

Not connected (* = marked no-connect by the designer): P8 3; U16 2(PC13-TAMPER-RTC) 4(PC15-OSC32_OUT) 8(PC0) 9(PC1) 26(PB0) 27(PB1) 33(PB12) 34(PB13) 35(PB14) 36(PB15) 40(PC9) 41(PA8) 50(PA15/JTDI) 51(PC10) 52(PC11) 53(PC12) 54(PD2) 55(PB3/JTDO) 56(PB4/JNTRST) 58(PB6) 59(PB7)

### Notes on the sheet
- 电压测量
- SPI接口To FPGA
- UART1
- 电子罗盘接口
- SWD 调试接口
- FLASH
- (near J2) UART1
- DHT温湿度传感器接口
- (near U21) FLASH

### Library data of the parts
BOOT1 = CON3: Connector
C47-C53 C58 C59 = CAP: Capacitor
C151 C152 = Cap: Capacitor; Published: 8-Jun-2000; LatestRevisionDate: 17-Jul-2002; LatestRevisionNote: Re-released for DXP Platform.; PackageReference: RAD-0.3; Publisher: Altium Limited
C153 C154 = Cap: Capacitor; Value: 100nF; Published: 8-Jun-2000; LatestRevisionDate: 17-Jul-2002; LatestRevisionNote: Re-released for DXP Platform.; PackageReference: RAD-0.3; Publisher: Altium Limited
J2 JP1 = CON4: Connector
P7 = Header 5: Header, 5-Pin; LatestRevisionDate: 17-Jul-2002; LatestRevisionNote: Re-released for DXP Platform.; Publisher: Altium Limited
P8 = Header 4: Header, 4-Pin; LatestRevisionDate: 17-Jul-2002; LatestRevisionNote: Re-released for DXP Platform.; Publisher: Altium Limited
R66 R70 R86 = Res1: Resistor; Published: *; Revision: *; Publisher: *; Value: *
R67 R87 = res1: Resistor; Published: *; Revision: *; Publisher: *; Value: *
R110-R123 = Res2: Resistor; Published: 8-Jun-2000; LatestRevisionDate: 17-Jul-2002; LatestRevisionNote: Re-released for DXP Platform.; PackageReference: AXIAL-0.4; Publisher: Altium Limited
U16 = STM32F103RBT6: STM32 ARM-based 32-bit MCU with 128 Kbytes Flash, 64-pin LQFP, Industrial Temperature; Published: *; DatasheetVersion: *; PackageVersion: *; PackageReference: *; Publisher: *; PackageDescription: *; ComponentLink1Description: *; ComponentLink1URL: *; ComponentLink2Description: *; ComponentLink2URL: *
U21 = 24C02
Y1 = XTAL: Crystal Oscillator

## Sheet FPGA_POWER.SchDoc
size A3
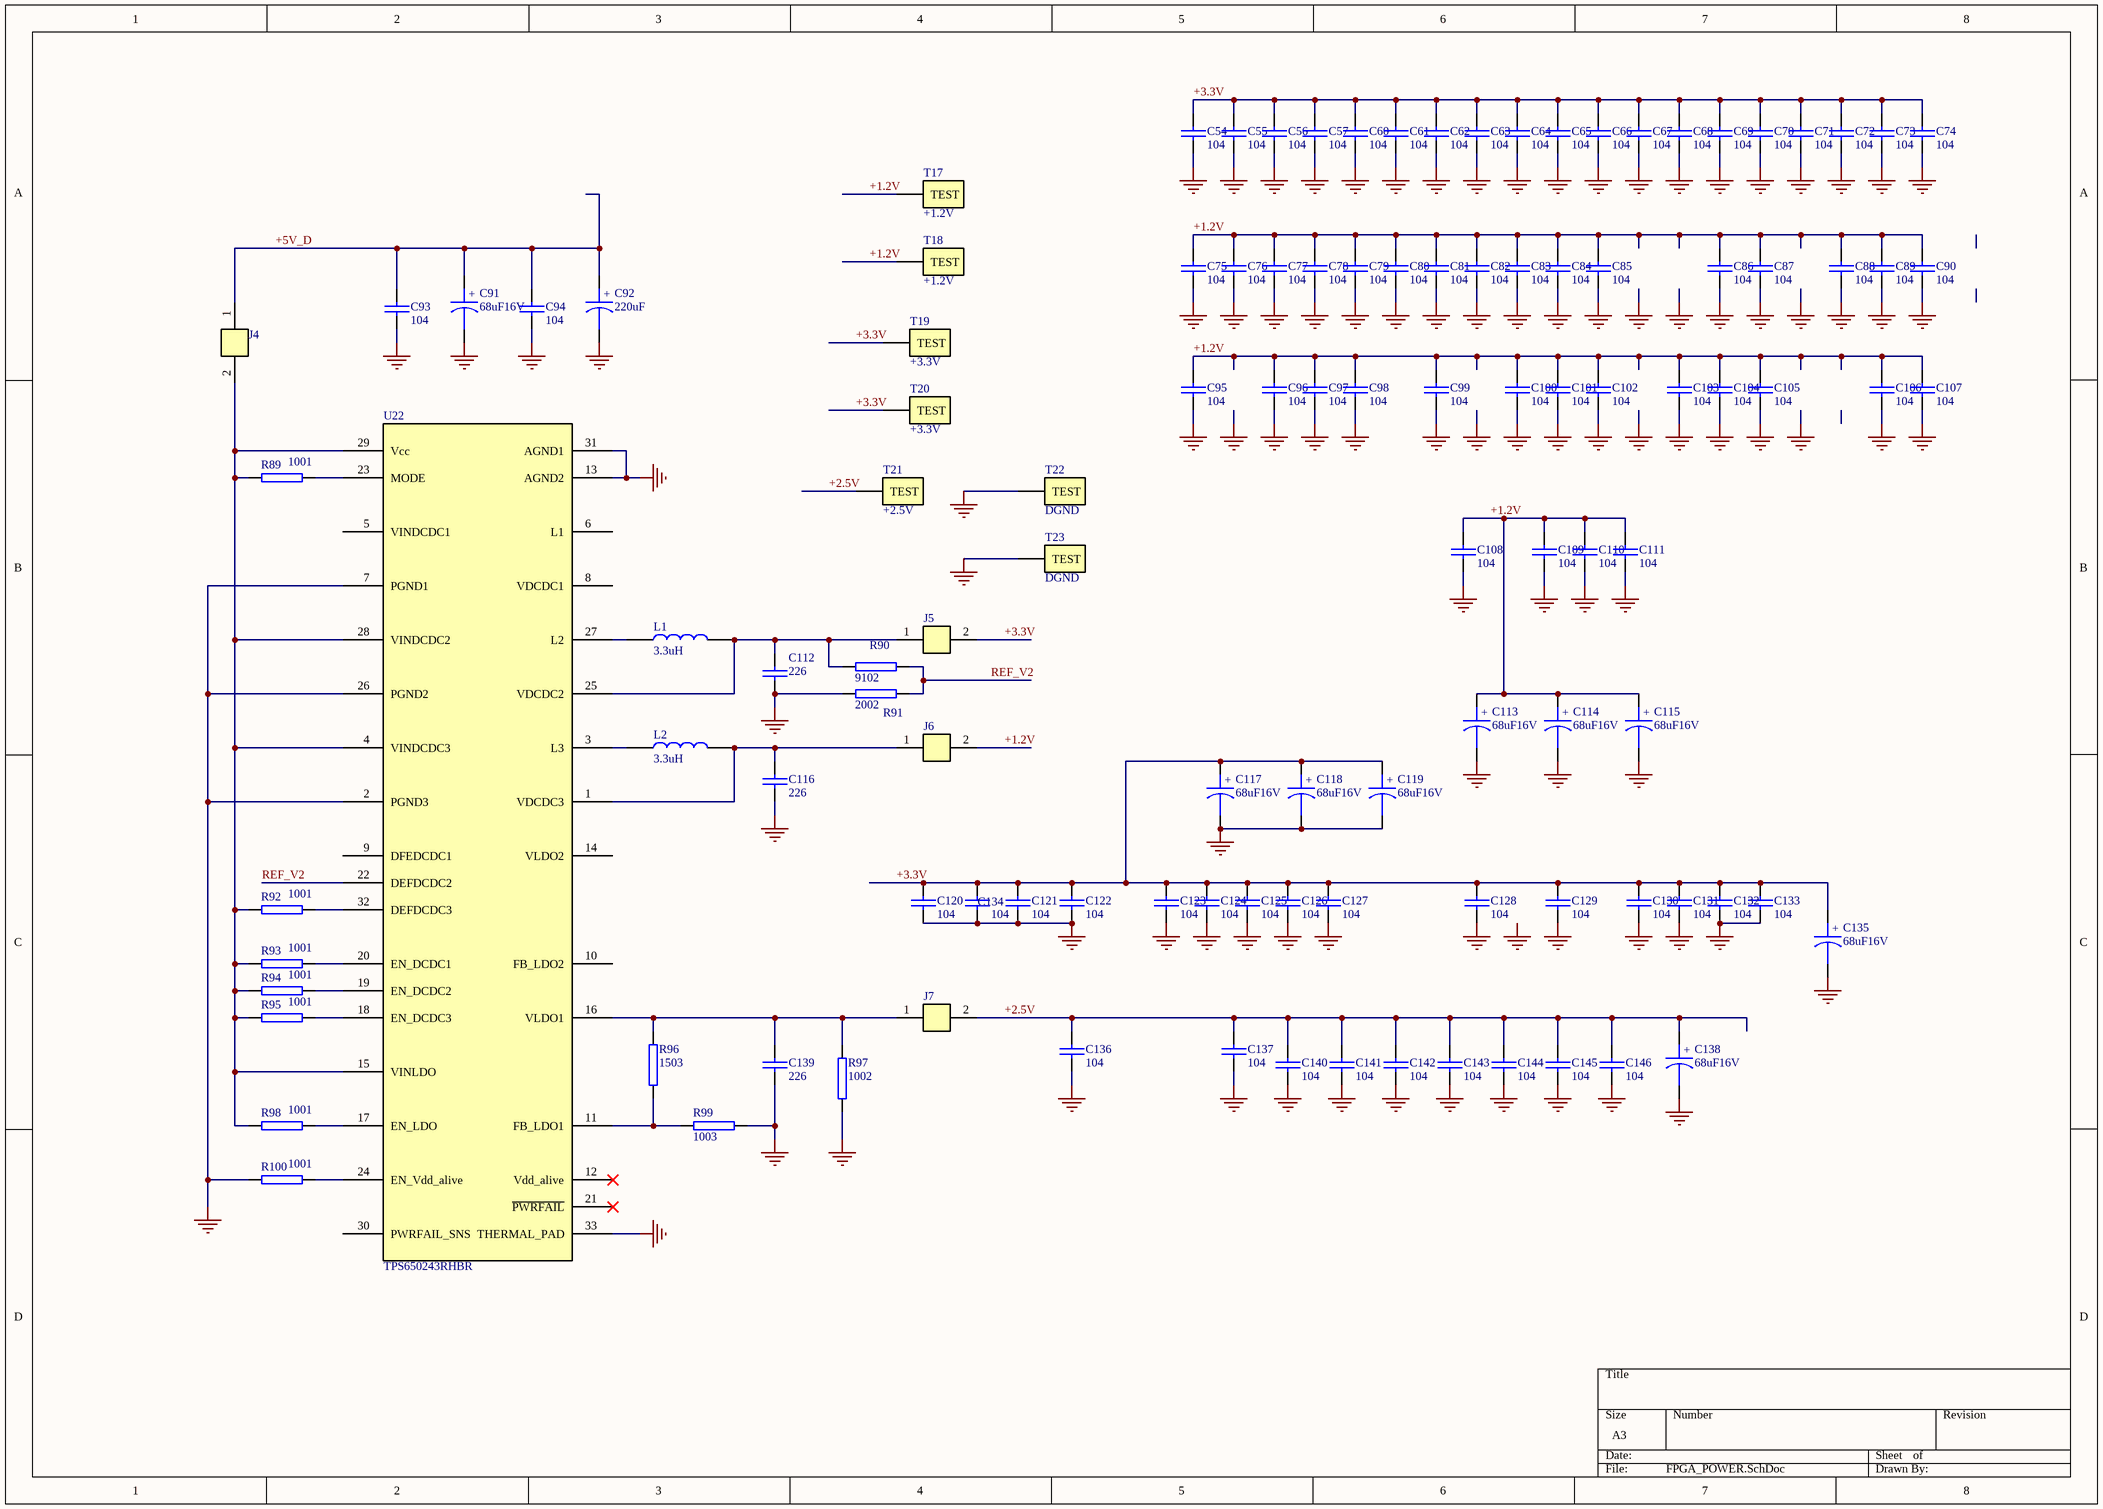
[diagram p11: FPGA_POWER.SchDoc]

### Parts
C54  104  [0805C]
C55  104  [0402C]
C56  104  [0402C]
C57  104  [0402C]
C60  104  [0402C]
C61  104  [0402C]
C62  104  [0402C]
C63  104  [0402C]
C64  104  [0402C]
C65  104  [0402C]
C66  104  [0402C]
C67  104  [0402C]
C68  104  [0402C]
C69  104  [0402C]
C70  104  [0402C]
C71  104  [0402C]
C72  104  [0402C]
C73  104  [0402C]
C74  104  [0402C]
C75  104  [0805C]
C76  104  [0402C]
C77  104  [0402C]
C78  104  [0805C]
C79  104  [0402C]
C80  104  [0402C]
C81  104  [0402C]
C82  104  [0402C]
C83  104  [0402C]
C84  104  [0402C]
C85  104  [0402C]
C86  104  [0402C]
C87  104  [0805C]
C88  104  [0402C]
C89  104  [0402C]
C90  104  [0402C]
C91  68uF16V  [6032]
C92  220uF  [c200]
C93  104  [0805C]
C94  104  [0805C]
C95  104  [0402C]
C96  104  [0402C]
C97  104  [0402C]
C98  104  [0402C]
C99  104  [0402C]
C100  104  [0402C]
C101  104  [0402C]
C102  104  [0402C]
C103  104  [0402C]
C104  104  [0402C]
C105  104  [0805C]
C106  104  [0402C]
C107  104  [0402C]
C108  104  [0402C]
C109  104  [0402C]
C110  104  [0402C]
C111  104  [0402C]
C112  226  [C226]
C113  68uF16V  [6032]
C114  68uF16V  [6032]
C115  68uF16V  [6032]
C116  226  [C226]
C117  68uF16V  [6032]
C118  68uF16V  [6032]
C119  68uF16V  [6032]
C120  104  [0402C]
C121  104  [0402C]
C122  104  [0805C]
C123  104  [0805C]
C124  104  [0805C]
C125  104  [0805C]
C126  104  [0805C]
C127  104  [0402C]
C128  104  [0805C]
C129  104  [0402C]
C130  104  [0402C]
C131  104  [0402C]
C132  104  [0402C]
C133  104  [0402C]
C134  104  [0402C]
C135  68uF16V  [6032]
C136  104  [0805C]
C137  104  [0805C]
C138  68uF16V  [6032]
C139  226  [C226]
C140  104  [0402C]
C141  104  [0402C]
C142  104  [0402C]
C143  104  [0402C]
C144  104  [0805C]
C145  104  [0402C]
C146  104  [0402C]
J4  (no value)  [I_ON1]
J5  (no value)  [I_ON1]
J6  (no value)  [I_ON1]
J7  (no value)  [I_ON1]
L1  3.3uH  [L3R3]
L2  3.3uH  [L3R3]
R89  1001  [0603]
R90  9102  [0603]
R91  2002  [0603]
R92  1001  [0603]
R93  1001  [0603]
R94  1001  [0603]
R95  1001  [0603]
R96  1503  [0603]
R97  1002  [0603]
R98  1001  [0603]
R99  1003  [0603]
R100  1001  [0603]
T17  +1.2V  [TEST]
T18  +1.2V  [TEST]
T19  +3.3V  [TEST]
T20  +3.3V  [TEST]
T21  +2.5V  [TEST]
T22  DGND  [TEST]
T23  DGND  [TEST]
U22  TPS650243RHBR  [VQFN32]

### Nets
DGND: C54.1 C55.1 C56.1 C57.1 C60.1 C61.1 C62.1 C63.1 C64.1 C65.1 C66.1 C67.1 C68.1 C69.1 C70.1 C71.1 C72.1 C73.1 C74.1 C75.1 C76.1 C77.1 C78.1 C79.1 C80.1 C81.1 C82.1 C83.1 C84.1 C85.1 C86.1 C87.1 C88.1 C89.1 C90.1 C91.2 C92.2 C93.1 C94.1 C95.1 C96.1 C97.1 C98.1 C99.1 C100.1 C101.1 C102.1 C103.1 C104.1 C105.1 C106.1 C107.1 C108.1 C109.1 C110.1 C111.1 C112.2 C113.2 C114.2 C115.2 C116.2 C117.2 C118.2 C119.2 C120.1 C121.1 C122.1 C123.1 C124.1 C125.1 C126.1 C127.1 C128.1 C129.1 C130.1 C131.1 C132.1 C133.1 C134.1 C135.2 C136.1 C137.1 C138.2 C139.2 C140.1 C141.1 C142.1 C143.1 C144.1 C145.1 C146.1 R91.2 R97.2 R99.2 R100.1 T22.1(TEST) T23.1(TEST) U22.2(PGND3) U22.7(PGND1) U22.13(AGND2) U22.26(PGND2) U22.31(AGND1) U22.33(THERMAL_PAD)
+1.2V: C75.2 C76.2 C77.2 C78.2 C79.2 C80.2 C81.2 C82.2 C83.2 C84.2 C85.2 C86.2 C87.2 C88.2 C89.2 C90.2 C95.2 C96.2 C97.2 C98.2 C99.2 C100.2 C101.2 C102.2 C103.2 C104.2 C105.2 C106.2 C107.2 C108.2 C109.2 C110.2 C111.2 C113.1 C114.1 C115.1 J6.2 T17.1(TEST) T18.1(TEST)
+2.5V: C136.2 C137.2 C138.1 C140.2 C141.2 C142.2 C143.2 C144.2 C145.2 C146.2 J7.2 T21.1(TEST)
+3.3V: C54.2 C55.2 C56.2 C57.2 C60.2 C61.2 C62.2 C63.2 C64.2 C65.2 C66.2 C67.2 C68.2 C69.2 C70.2 C71.2 C72.2 C73.2 C74.2 C117.1 C118.1 C119.1 C120.2 C121.2 C122.2 C123.2 C124.2 C125.2 C126.2 C127.2 C128.2 C129.2 C130.2 C131.2 C132.2 C133.2 C134.2 C135.1 J5.2 T19.1(TEST) T20.1(TEST)
+5V_D: C91.1 C92.1 C93.2 C94.2 J4.1
REF_V2: R90.2 R91.1 U22.22(DEFDCDC2)
NetC112_1: C112.1 J5.1 L1.2 R90.1 U22.25(VDCDC2)
NetC116_1: C116.1 J6.1 L2.2 U22.1(VDCDC3)
NetC139_1: C139.1 J7.1 R96.2 R97.1 U22.16(VLDO1)
NetJ4_2: J4.2 R89.1 R92.1 R93.1 R94.1 R95.1 R98.1 U22.4(VINDCDC3) U22.15(VINLDO) U22.28(VINDCDC2) U22.29(Vcc)
NetL1_1: L1.1 U22.27(L2)
NetL2_1: L2.1 U22.3(L3)
NetR89_2: R89.2 U22.23(MODE)
NetR92_2: R92.2 U22.32(DEFDCDC3)
NetR93_2: R93.2 U22.20(EN_DCDC1)
NetR94_2: R94.2 U22.19(EN_DCDC2)
NetR95_2: R95.2 U22.18(EN_DCDC3)
NetR96_1: R96.1 R99.1 U22.11(FB_LDO1)
NetR98_2: R98.2 U22.17(EN_LDO)
NetR100_2: R100.2 U22.24(EN_Vdd_alive)

Not connected (* = marked no-connect by the designer): U22 5(VINDCDC1) 6(L1) 8(VDCDC1) 9(DFEDCDC1) 10(FB_LDO2) 12(Vdd_alive)* 14(VLDO2) 21(~{PWRFAIL})* 30(PWRFAIL_SNS)

### Notes on the sheet
- Labels drawn without touching a wire or pin: DGND
- (in symbol CAPACITOR POL) +

### Library data of the parts
C54-C57 C60-C90 C93-C112 C116 C120-C134 C136 C137 C139-C146 = CAP: Capacitor
C91 C92 C113-C115 C117-C119 C135 C138 = CAPACITOR POL: Capacitor
J4-J7 = I_ON
L1 L2 = L
R89-R100 = RES2
T17-T23 = TEST
U22 = TPS650243

## Nets that join several sheets
3V3: Power (R6.1), STM32F103RBT6 (21 pins)
AGND: CH1_CH2 (49 pins), CH3 (23 pins), Power (R7.1 R68.1 T7.1)
DGND: 485Driver_MAX3462 (19 pins), CH1_CH2 (R19.2 R36.2 U6.22 U10.22), CH3 (R53.2 U14.22), Power (15 pins), EP3CE75F484 (102 pins), STM32F103RBT6 (35 pins), FPGA_POWER (103 pins)
+1.2V: EP3CE75F484 (58 pins), FPGA_POWER (39 pins)
+2.5V: EP3CE75F484 (5 pins), FPGA_POWER (12 pins)
+3.3V: EP3CE75F484 (47 pins), FPGA_POWER (41 pins)
+3.3V_AD: CH1_CH2 (U6.24 U10.24), CH3 (U14.24), Power (7 pins)
+5V1: CH1_CH2 (C13.2 U5.7 U7.3), Power (R60.1 R61.2)
+5V2: CH1_CH2 (C22.2 U9.7 U11.3), Power (R62.1 R63.2)
+5V3: CH3 (C31.2 U13.7 U15.3), Power (R64.1 R65.2)
+5V_485: 485Driver_MAX3462 (11 pins), Power (C155.1 L3.2 U28.4)
+5V_D: Power (6 pins), FPGA_POWER (5 pins)
+5VA: CH1_CH2 (6 pins), Power (R61.1)
+5VB: CH1_CH2 (C18.2 U10.5 U10.23), Power (R63.1)
+5VC: CH3 (C27.2 U14.5 U14.23), Power (R65.1)
+12V: Power (10 pins), STM32F103RBT6 (C153.2 R110.2 U27.4)
+VREFA: CH1_CH2 (5 pins), CH3 (C35.1 U14.17)
-5V1: CH1_CH2 (C14.2 U5.4 U7.6), Power (R69.1)
-5V2: CH1_CH2 (C23.2 U9.4 U11.6), Power (R71.1)
-5V3: CH3 (C32.2 U13.4 U15.6), Power (R72.1)
-12V: Power (6 pins), STM32F103RBT6 (C154.1 R113.2 U27.11)
CMD_BUS: 485Driver_MAX3462 (R104.2), EP3CE75F484 (U18.D20)
DIN_1A: CH1_CH2 (R17.2), EP3CE75F484 (U18.E14)
DIN_2A: CH1_CH2 (R34.2), EP3CE75F484 (U18.E13)
DIN_3A: CH3 (R51.2), EP3CE75F484 (U18.E11)
DOUT_1A: CH1_CH2 (R14.2), EP3CE75F484 (U18.C15)
DOUT_2A: CH1_CH2 (R31.2), EP3CE75F484 (U18.D13)
DOUT_3A: CH3 (R48.2), EP3CE75F484 (U18.E12)
GPS_Timer: 485Driver_MAX3462 (R103.2), EP3CE75F484 (U18.F17)
Main_Data: 485Driver_MAX3462 (R105.1), EP3CE75F484 (U18.C20)
Main_Data_RxEN: 485Driver_MAX3462 (R106.1), EP3CE75F484 (U18.B22)
Main_Data_TxEN: 485Driver_MAX3462 (R102.1), EP3CE75F484 (U18.B21)
MCLK_A: CH1_CH2 (U6.30), EP3CE75F484 (U18.K22)
MCLK_B: CH1_CH2 (U10.30), EP3CE75F484 (U18.K19)
MCLK_C: CH3 (U14.30), EP3CE75F484 (U18.L21)
MCU_FPGA_BAK1: EP3CE75F484 (U18.E8), STM32F103RBT6 (U16.10)
MCU_FPGA_BAK2: EP3CE75F484 (U18.A5), STM32F103RBT6 (U16.11)
MCU_FPGA_BAK3: EP3CE75F484 (U18.B5), STM32F103RBT6 (U16.24)
MCU_FPGA_BAK4: EP3CE75F484 (U18.F10), STM32F103RBT6 (U16.25)
MCU_FPGA_BAK5: EP3CE75F484 (U18.C6), STM32F103RBT6 (U16.37)
MCU_FPGA_BAK6: EP3CE75F484 (U18.D7), STM32F103RBT6 (U16.38)
SCLK_1A: CH1_CH2 (R18.2), EP3CE75F484 (U18.F13)
SCLK_2A: CH1_CH2 (R35.2), EP3CE75F484 (U18.A14)
SCLK_3A: CH3 (R52.2), EP3CE75F484 (U18.F11)
SPI1_MISO: EP3CE75F484 (U18.E6), STM32F103RBT6 (U16.22)
SPI1_MOSI: EP3CE75F484 (U18.E5), STM32F103RBT6 (U16.23)
SPI1_NSS: EP3CE75F484 (U18.G7), STM32F103RBT6 (U16.20)
SPI1_SCK: EP3CE75F484 (U18.F9), STM32F103RBT6 (U16.21)
SYNC_1A: CH1_CH2 (R22.2), EP3CE75F484 (U18.B16)
SYNC_2A: CH1_CH2 (R39.2), EP3CE75F484 (U18.C13)
SYNC_3A: CH3 (R56.2), EP3CE75F484 (U18.B13)
Test_I+: Power (R108.1), STM32F103RBT6 (U27.10)
Test_I-: Power (R109.1), STM32F103RBT6 (U27.12)